# EAGLE design transponder-9.3.0 (EAGLE 9.6.1)

## Sheet 1 of 7
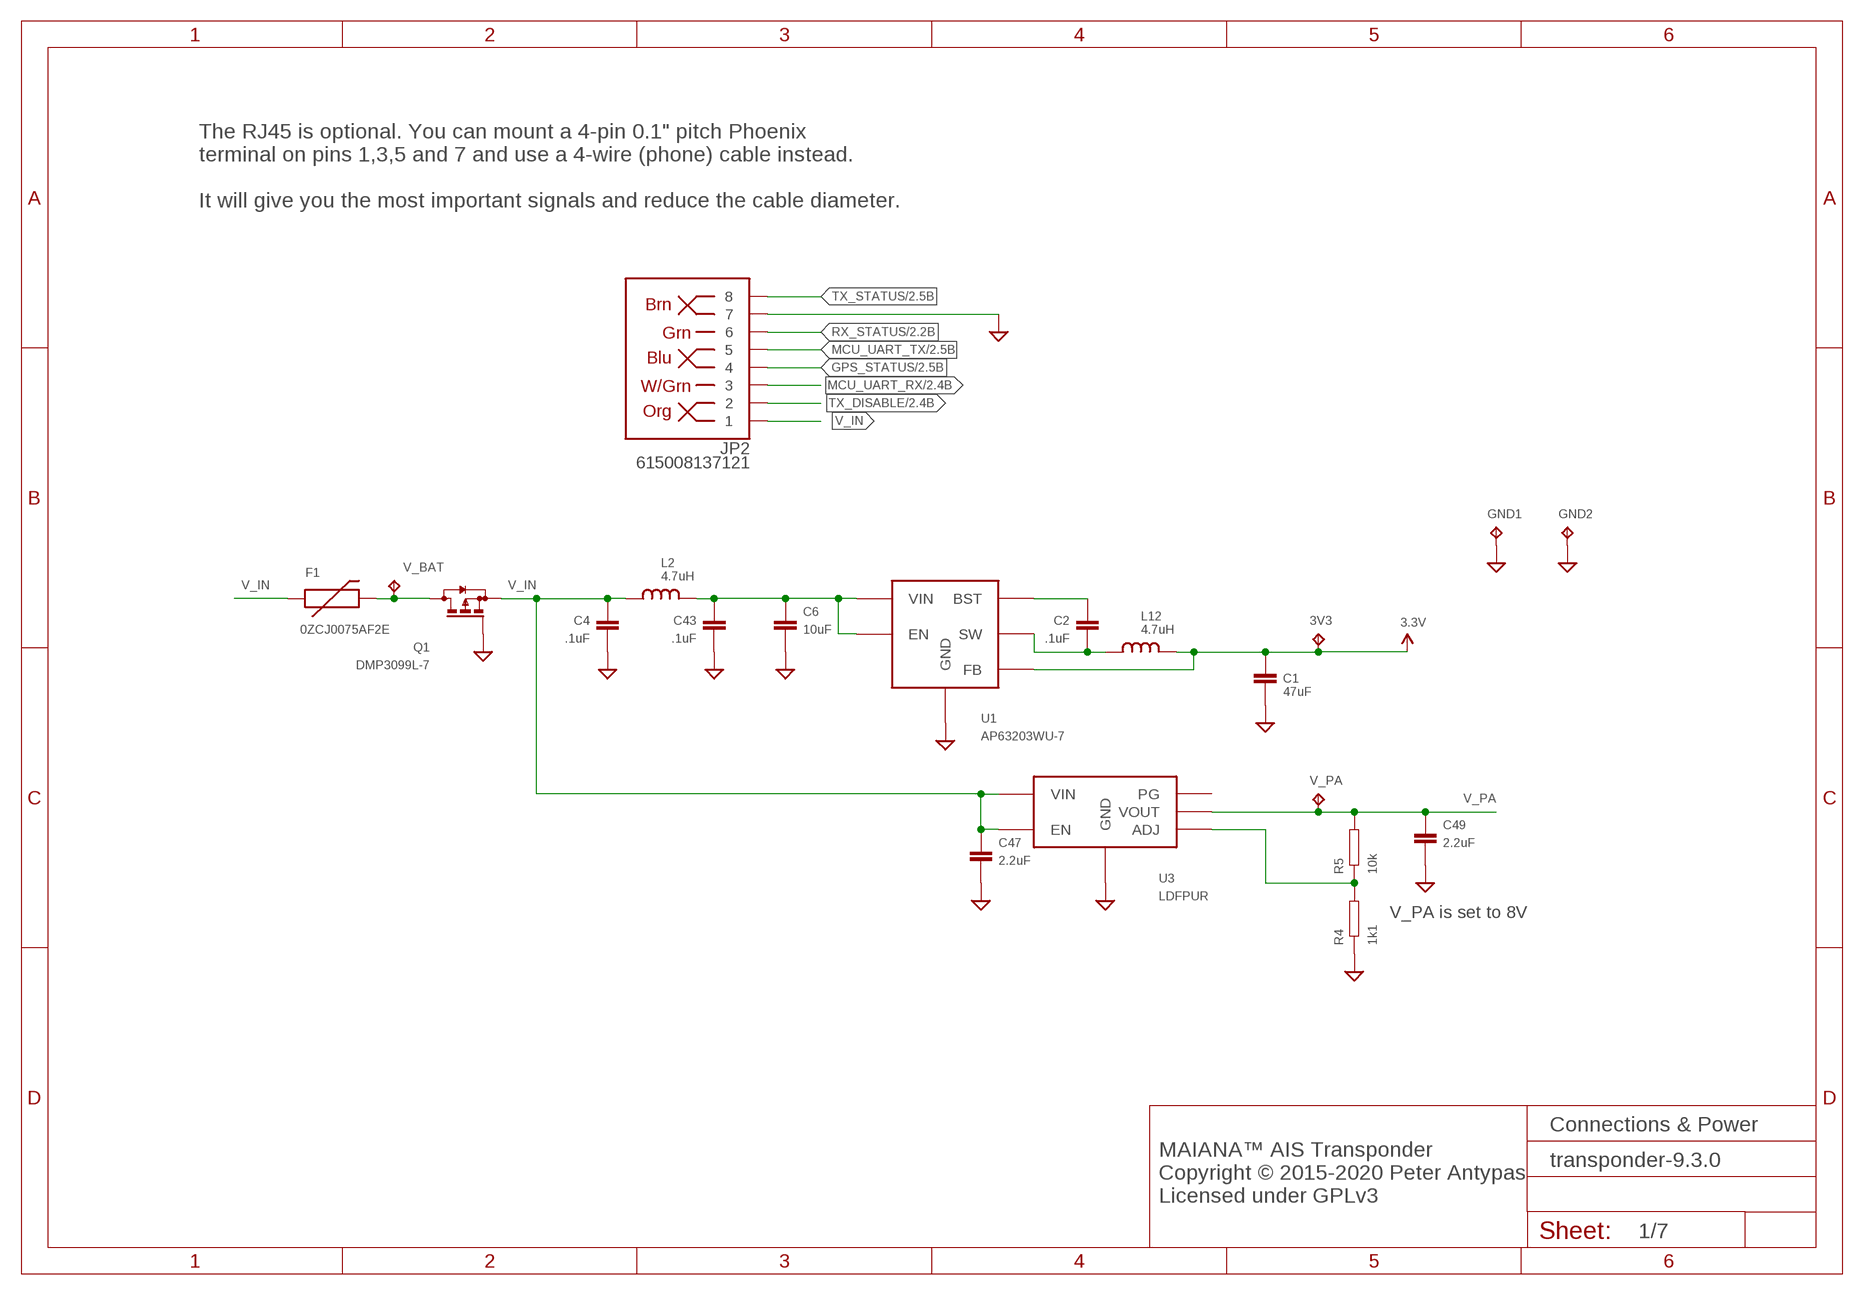
[diagram p0: schematic, sheet 1]

### Parts
3V3  TPTP12R  [TP12R]
C1  47uF  CAPACITOR1206  [1206]
C2  .1uF  CAPACITOR0603  [0603]
C4  .1uF  CAPACITOR0603  [0603]
C6  10uF  CAPACITOR0805  [0805]
C43  .1uF  CAPACITOR0603  [0603]
C47  2.2uF  CAPACITOR0603  [0603]
C49  2.2uF  CAPACITOR0603  [0603]
F1  0ZCJ0075AF2E  PTCSMD  [PTC-1206]
GND1  TPTP16R  [TP16R]
GND2  TPTP16R  [TP16R]
JP2  615008137121  RJ45-8PTH  [RJ45-8]
L2  4.7uH  INDUCTOR0805  [0805]
L12  4.7uH  INDUCTOR0805  [0805]
Q1  DMP3099L-7  BSS84  [SOT23]
R4  1k1  RESISTOR0603  [0603]
R5  10k  RESISTOR0603  [0603]
U1  AP63203WU-7  AP63203  [SOT23-6]
U3  LDFPUR  LDF  [DFN-6]
V_BAT  TPTP12R  [TP12R]
V_PA  TPTP12R  [TP12R]

### Nets
3.3V: 3V3.TP C1.P$1 L12.P$2 U1.1(FB) ; also sheet 2,3,4,6,7
BST: C2.P$1 U1.6(BST)
GND: C1.P$2 C4.P$2 C6.P$2 C43.P$2 C47.P$2 C49.P$2 GND1.TP GND2.TP JP2.7 Q1.1(G) R4.P$1 U1.4(GND) U3.P$4(GND) U3.P$7(GND) ; also sheet 2,3,4,5,6,7
GPS_STATUS: JP2.4 ; also sheet 2
MCU_UART_RX: JP2.3 ; also sheet 2
MCU_UART_TX: JP2.5 ; also sheet 2
N$27: C6.P$1 C43.P$1 L2.P$2 U1.2(EN) U1.3(VIN)
N$32: R4.P$2 R5.P$1 U3.P$2(ADJ)
RX_STATUS: JP2.6 ; also sheet 2
SW: C2.P$2 L12.P$1 U1.5(SW)
TX_DISABLE: JP2.2 ; also sheet 2
TX_STATUS: JP2.8 ; also sheet 2
V_BAT: F1.2 Q1.3(D) V_BAT.TP
V_IN: C4.P$1 C47.P$1 F1.1 JP2.1 L2.P$1 Q1.2(S) U3.P$5(EN) U3.P$6(VIN)
V_PA: C49.P$1 R5.P$2 U3.P$1(VOUT) V_PA.TP ; also sheet 5
Unconnected: U3.P$3(PG)

### Notes on the sheet
- The RJ45 is optional. You can mount a 4-pin 0.1" pitch Phoenix 
  terminal on pins 1,3,5 and 7 and use a 4-wire (phone) cable instead.
  
  It will give you the most important signals and reduce the cable diameter.
- V_PA is set to 8V
- Connections & Power
- MAIANA™ AIS Transponder
  Copyright © 2015-2020 Peter Antypas
  Licensed under GPLv3

## Sheet 2 of 7
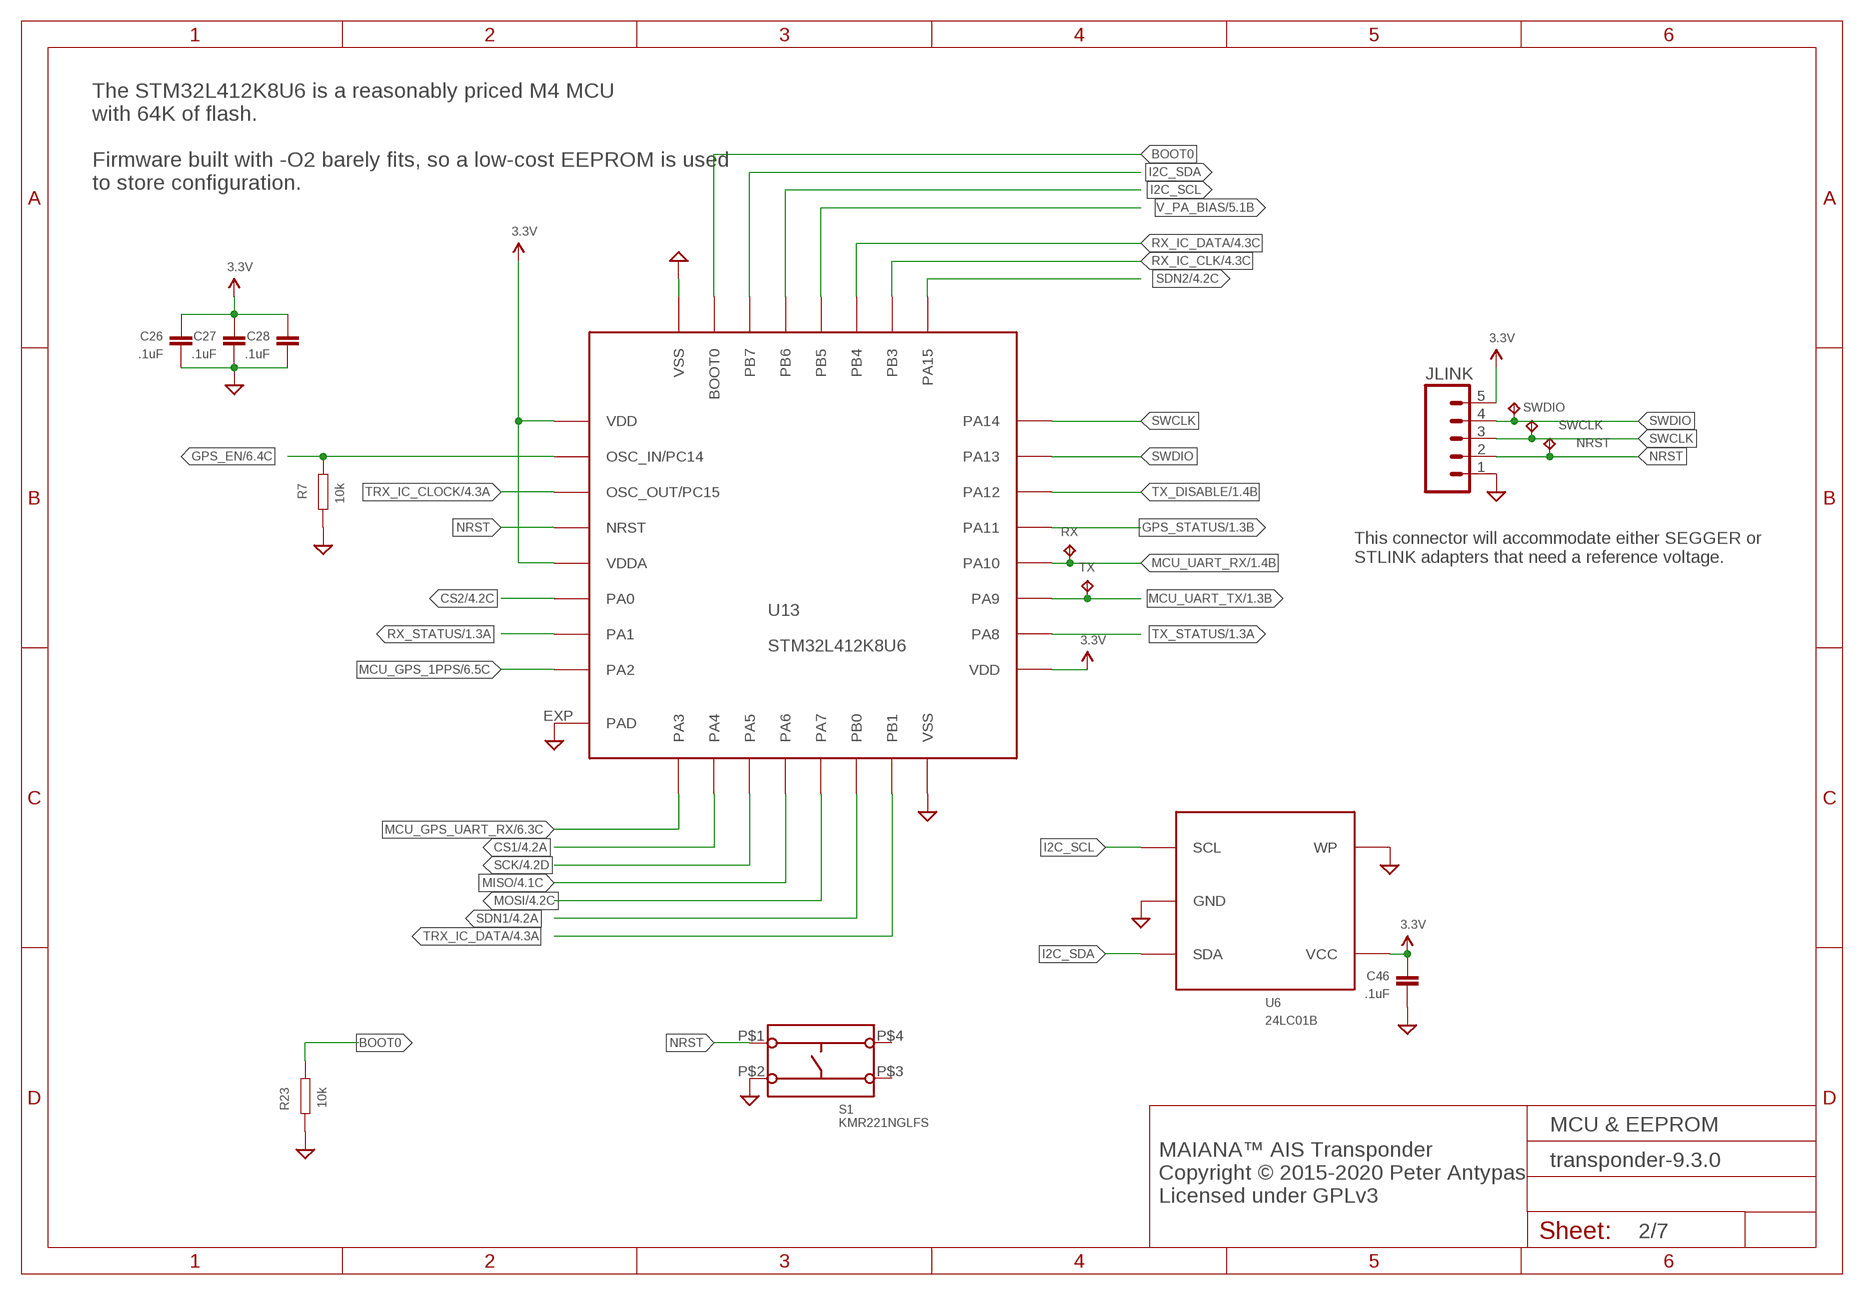
[diagram p1: schematic, sheet 2]

### Parts
C26  .1uF  CAPACITOR0603  [0603]
C27  .1uF  CAPACITOR0603  [0603]
C28  .1uF  CAPACITOR0603  [0603]
C46  .1uF  CAPACITOR0603  [0603]
JLINK  M05PTH  [1X05]
NRST  TPTP12R  [TP12R]
R7  10k  RESISTOR0603  [0603]
R23  10k  RESISTOR0603  [0603]
RX  TPTP12R  [TP12R]
S1  KMR221NGLFS  [KMR221NGLFS]
SWCLK  TPTP12R  [TP12R]
SWDIO  TPTP12R  [TP12R]
TX  TPTP12R  [TP12R]
U6  24LC01B  [SOT23-5]
U13  STM32L412K8U6  STM32L432KXXX  [QFN32]

### Nets
3.3V: C26.P$1 C27.P$1 C28.P$1 C46.P$1 JLINK.5 U6.4(VCC) U13.1(VDD) U13.5(VDDA) U13.17(VDD) ; also sheet 1,3,4,6,7
BOOT0: R23.P$1 U13.31(BOOT0)
CS1: U13.10(PA4) ; also sheet 4
CS2: U13.6(PA0) ; also sheet 4
GND: C26.P$2 C27.P$2 C28.P$2 C46.P$2 JLINK.1 R7.P$2 R23.P$2 S1.P$2(S2) U6.2(GND) U6.5(WP) U13.16(VSS) U13.32(VSS) U13.EXP(PAD) ; also sheet 1,3,4,5,6,7
GPS_EN: R7.P$1 U13.2(OSC_IN/PC14) ; also sheet 6
GPS_STATUS: U13.21(PA11) ; also sheet 1
I2C_SCL: U6.1(SCL) U13.29(PB6)
I2C_SDA: U6.3(SDA) U13.30(PB7)
MCU_GPS_1PPS: U13.8(PA2) ; also sheet 6
MCU_GPS_UART_RX: U13.9(PA3) ; also sheet 6
MCU_UART_RX: RX.TP U13.20(PA10) ; also sheet 1
MCU_UART_TX: TX.TP U13.19(PA9) ; also sheet 1
MISO: U13.12(PA6) ; also sheet 4
MOSI: U13.13(PA7) ; also sheet 4
NRST: JLINK.2 NRST.TP S1.P$1(S1) U13.4(NRST)
RX_IC_CLK: U13.26(PB3) ; also sheet 4
RX_IC_DATA: U13.27(PB4) ; also sheet 4
RX_STATUS: U13.7(PA1) ; also sheet 1
SCK: U13.11(PA5) ; also sheet 4
SDN1: U13.14(PB0) ; also sheet 4
SDN2: U13.25(PA15) ; also sheet 4
SWCLK: JLINK.3 SWCLK.TP U13.24(PA14)
SWDIO: JLINK.4 SWDIO.TP U13.23(PA13)
TRX_IC_CLOCK: U13.3(OSC_OUT/PC15) ; also sheet 4
TRX_IC_DATA: U13.15(PB1) ; also sheet 4
TX_DISABLE: U13.22(PA12) ; also sheet 1
TX_STATUS: U13.18(PA8) ; also sheet 1
V_PA_BIAS: U13.28(PB5) ; also sheet 5
Unconnected: S1.P$3(S2) S1.P$4(S1)

### Notes on the sheet
- The STM32L412K8U6 is a reasonably priced M4 MCU
  with 64K of flash. 
  
  Firmware built with -O2 barely fits, so a low-cost EEPROM is used
  to store configuration.
- This connector will accommodate either SEGGER or
  STLINK adapters that need a reference voltage.
- MCU & EEPROM
- MAIANA™ AIS Transponder
  Copyright © 2015-2020 Peter Antypas
  Licensed under GPLv3

## Sheet 3 of 7
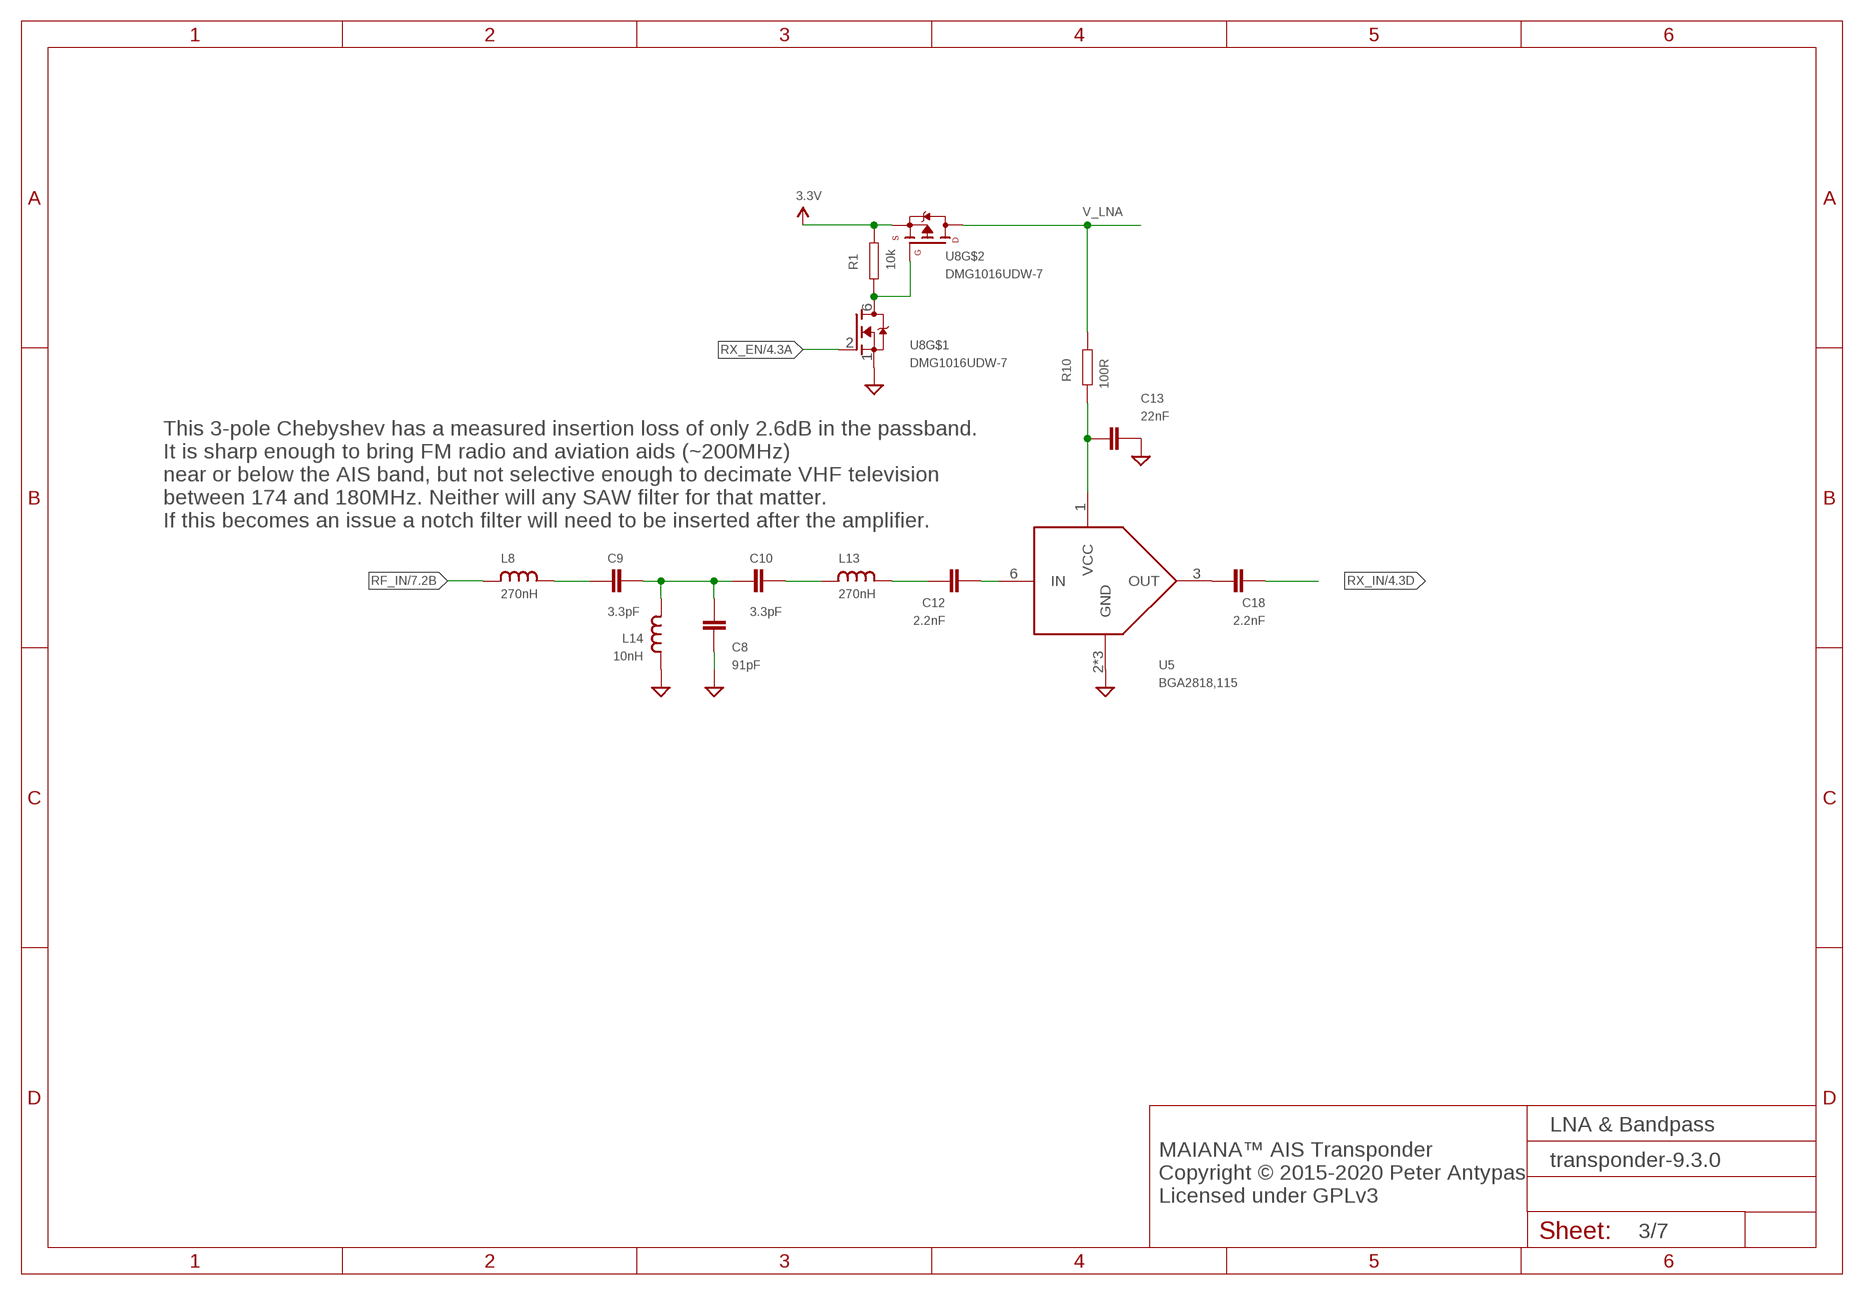
[diagram p2: schematic, sheet 3]

### Parts
C8  91pF  CAPACITOR0603  [0603]
C9  3.3pF  CAPACITOR0603  [0603]
C10  3.3pF  CAPACITOR0603  [0603]
C12  2.2nF  CAPACITOR0603  [0603]
C13  22nF  CAPACITOR0603  [0603]
C18  2.2nF  CAPACITOR0603  [0603]
L8  270nH  INDUCTOR0603  [0603]
L13  270nH  INDUCTOR0603  [0603]
L14  10nH  INDUCTOR0603  [0603]
R1  10k  RESISTOR0603  [0603]
R10  100R  RESISTOR0603  [0603]
U5  BGA2818,115  BGA2870  [SOT363]
U8  DMG1016UDW-7  DMG1016UDW  [SOT363]

### Nets
3.3V: R1.P$2 U8.4(S) ; also sheet 1,2,4,6,7
GND: C8.P$2 C13.P$2 L14.P$1 U5.2(GND) U5.4(GND) U5.5(GND) U8.1(S) ; also sheet 1,2,4,5,6,7
N$1: C12.P$2 U5.6(IN)
N$2: C9.P$1 L8.P$2
N$3: C8.P$1 C9.P$2 C10.P$1 L14.P$2
N$4: C10.P$2 L13.P$1
N$5: C12.P$1 L13.P$2
N$6: C13.P$1 R10.P$2 U5.1(VCC)
N$9: C18.P$1 U5.3(OUT)
N$10: R1.P$1 U8.5(G) U8.6(D)
RF_IN: L8.P$1 ; also sheet 7
RX_EN: U8.2(G) ; also sheet 4,7
RX_IN: C18.P$2 ; also sheet 4
V_LNA: R10.P$1 U8.3(D)

### Notes on the sheet
- This 3-pole Chebyshev has a measured insertion loss of only 2.6dB in the passband.
  It is sharp enough to bring FM radio and aviation aids (~200MHz)
  near or below the AIS band, but not selective enough to decimate VHF television
  between 174 and 180MHz. Neither will any SAW filter for that matter. 
  If this becomes an issue a notch filter will need to be inserted after the amplifier.
- LNA & Bandpass
- MAIANA™ AIS Transponder
  Copyright © 2015-2020 Peter Antypas
  Licensed under GPLv3

## Sheet 4 of 7
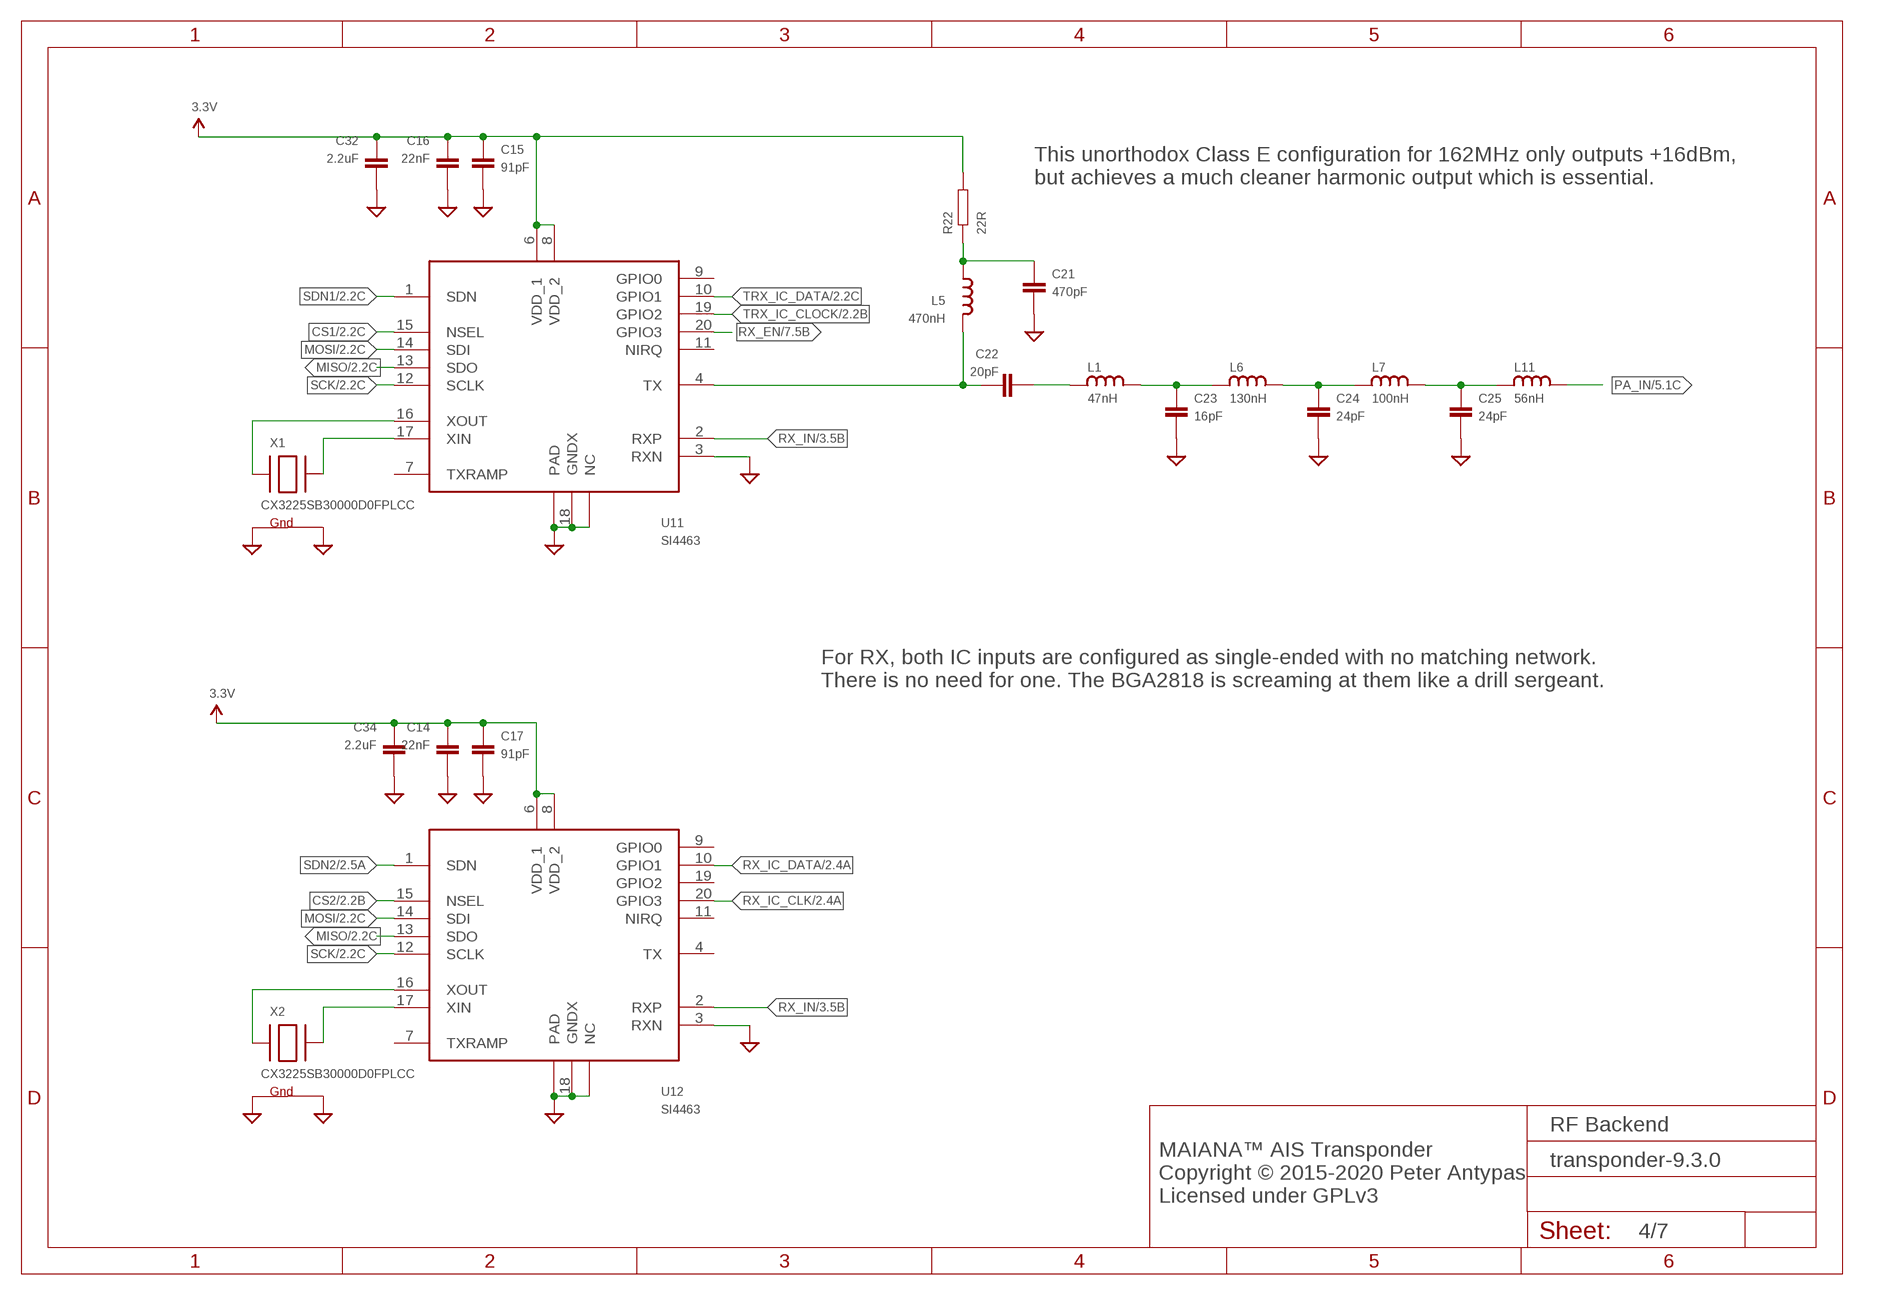
[diagram p3: schematic, sheet 4]

### Parts
C14  22nF  CAPACITOR0603  [0603]
C15  91pF  CAPACITOR0603  [0603]
C16  22nF  CAPACITOR0603  [0603]
C17  91pF  CAPACITOR0603  [0603]
C21  470pF  CAPACITOR0603  [0603]
C22  20pF  CAPACITOR0603  [0603]
C23  16pF  CAPACITOR0603  [0603]
C24  24pF  CAPACITOR0603  [0603]
C25  24pF  CAPACITOR0603  [0603]
C32  2.2uF  CAPACITOR0603  [0603]
C34  2.2uF  CAPACITOR0603  [0603]
L1  47nH  INDUCTOR0603  [0603]
L5  470nH  INDUCTOR0603  [0603]
L6  130nH  INDUCTOR0603  [0603]
L7  100nH  INDUCTOR0603  [0603]
L11  56nH  INDUCTOR0603  [0603]
R22  22R  RESISTOR0603  [0603]
U11  SI4463  [SI4463]
U12  SI4463  [SI4463]
X1  CX3225SB30000D0FPLCC  XTAL-4-3225  [NX3225]
X2  CX3225SB30000D0FPLCC  XTAL-4-3225  [NX3225]

### Nets
3.3V: C14.P$1 C15.P$1 C16.P$1 C17.P$1 C32.P$1 C34.P$1 R22.P$2 U11.6(VDD_1) U11.8(VDD_2) U12.6(VDD_1) U12.8(VDD_2) ; also sheet 1,2,3,6,7
CS1: U11.15(NSEL) ; also sheet 2
CS2: U12.15(NSEL) ; also sheet 2
GND: C14.P$2 C15.P$2 C16.P$2 C17.P$2 C21.P$2 C23.P$2 C24.P$2 C25.P$2 C32.P$2 C34.P$2 U11.3(RXN) U11.5(NC) U11.18(GNDX) U11.EXP(PAD) U12.3(RXN) U12.5(NC) U12.18(GNDX) U12.EXP(PAD) X1.2(G2) X1.4(G1) X2.2(G2) X2.4(G1) ; also sheet 1,2,3,5,6,7
MISO: U11.13(SDO) U12.13(SDO) ; also sheet 2
MOSI: U11.14(SDI) U12.14(SDI) ; also sheet 2
N$7: C24.P$1 L6.P$2 L7.P$1
N$11: C25.P$1 L7.P$2 L11.P$1
N$12: C23.P$1 L1.P$2 L6.P$1
N$16: U12.16(XOUT) X2.1(X1)
N$17: U12.17(XIN) X2.3(X2)
N$18: U11.16(XOUT) X1.1(X1)
N$19: U11.17(XIN) X1.3(X2)
N$24: C22.P$1 L5.P$2 U11.4(TX)
N$30: C21.P$1 L5.P$1 R22.P$1
N$31: C22.P$2 L1.P$1
PA_IN: L11.P$2 ; also sheet 5
RX_EN: U11.20(GPIO3) ; also sheet 3,7
RX_IC_CLK: U12.20(GPIO3) ; also sheet 2
RX_IC_DATA: U12.10(GPIO1) ; also sheet 2
RX_IN: U11.2(RXP) U12.2(RXP) ; also sheet 3
SCK: U11.12(SCLK) U12.12(SCLK) ; also sheet 2
SDN1: U11.1(SDN) ; also sheet 2
SDN2: U12.1(SDN) ; also sheet 2
TRX_IC_CLOCK: U11.19(GPIO2) ; also sheet 2
TRX_IC_DATA: U11.10(GPIO1) ; also sheet 2
Unconnected: U11.7(TXRAMP) U11.9(GPIO0) U11.11(NIRQ) U12.4(TX) U12.7(TXRAMP) U12.9(GPIO0) U12.11(NIRQ) U12.19(GPIO2)

### Notes on the sheet
- This unorthodox Class E configuration for 162MHz only outputs +16dBm,  
  but achieves a much cleaner harmonic output which is essential.
- For RX, both IC inputs are configured as single-ended with no matching network. 
  There is no need for one. The BGA2818 is screaming at them like a drill sergeant.
- RF Backend
- MAIANA™ AIS Transponder
  Copyright © 2015-2020 Peter Antypas
  Licensed under GPLv3

## Sheet 5 of 7
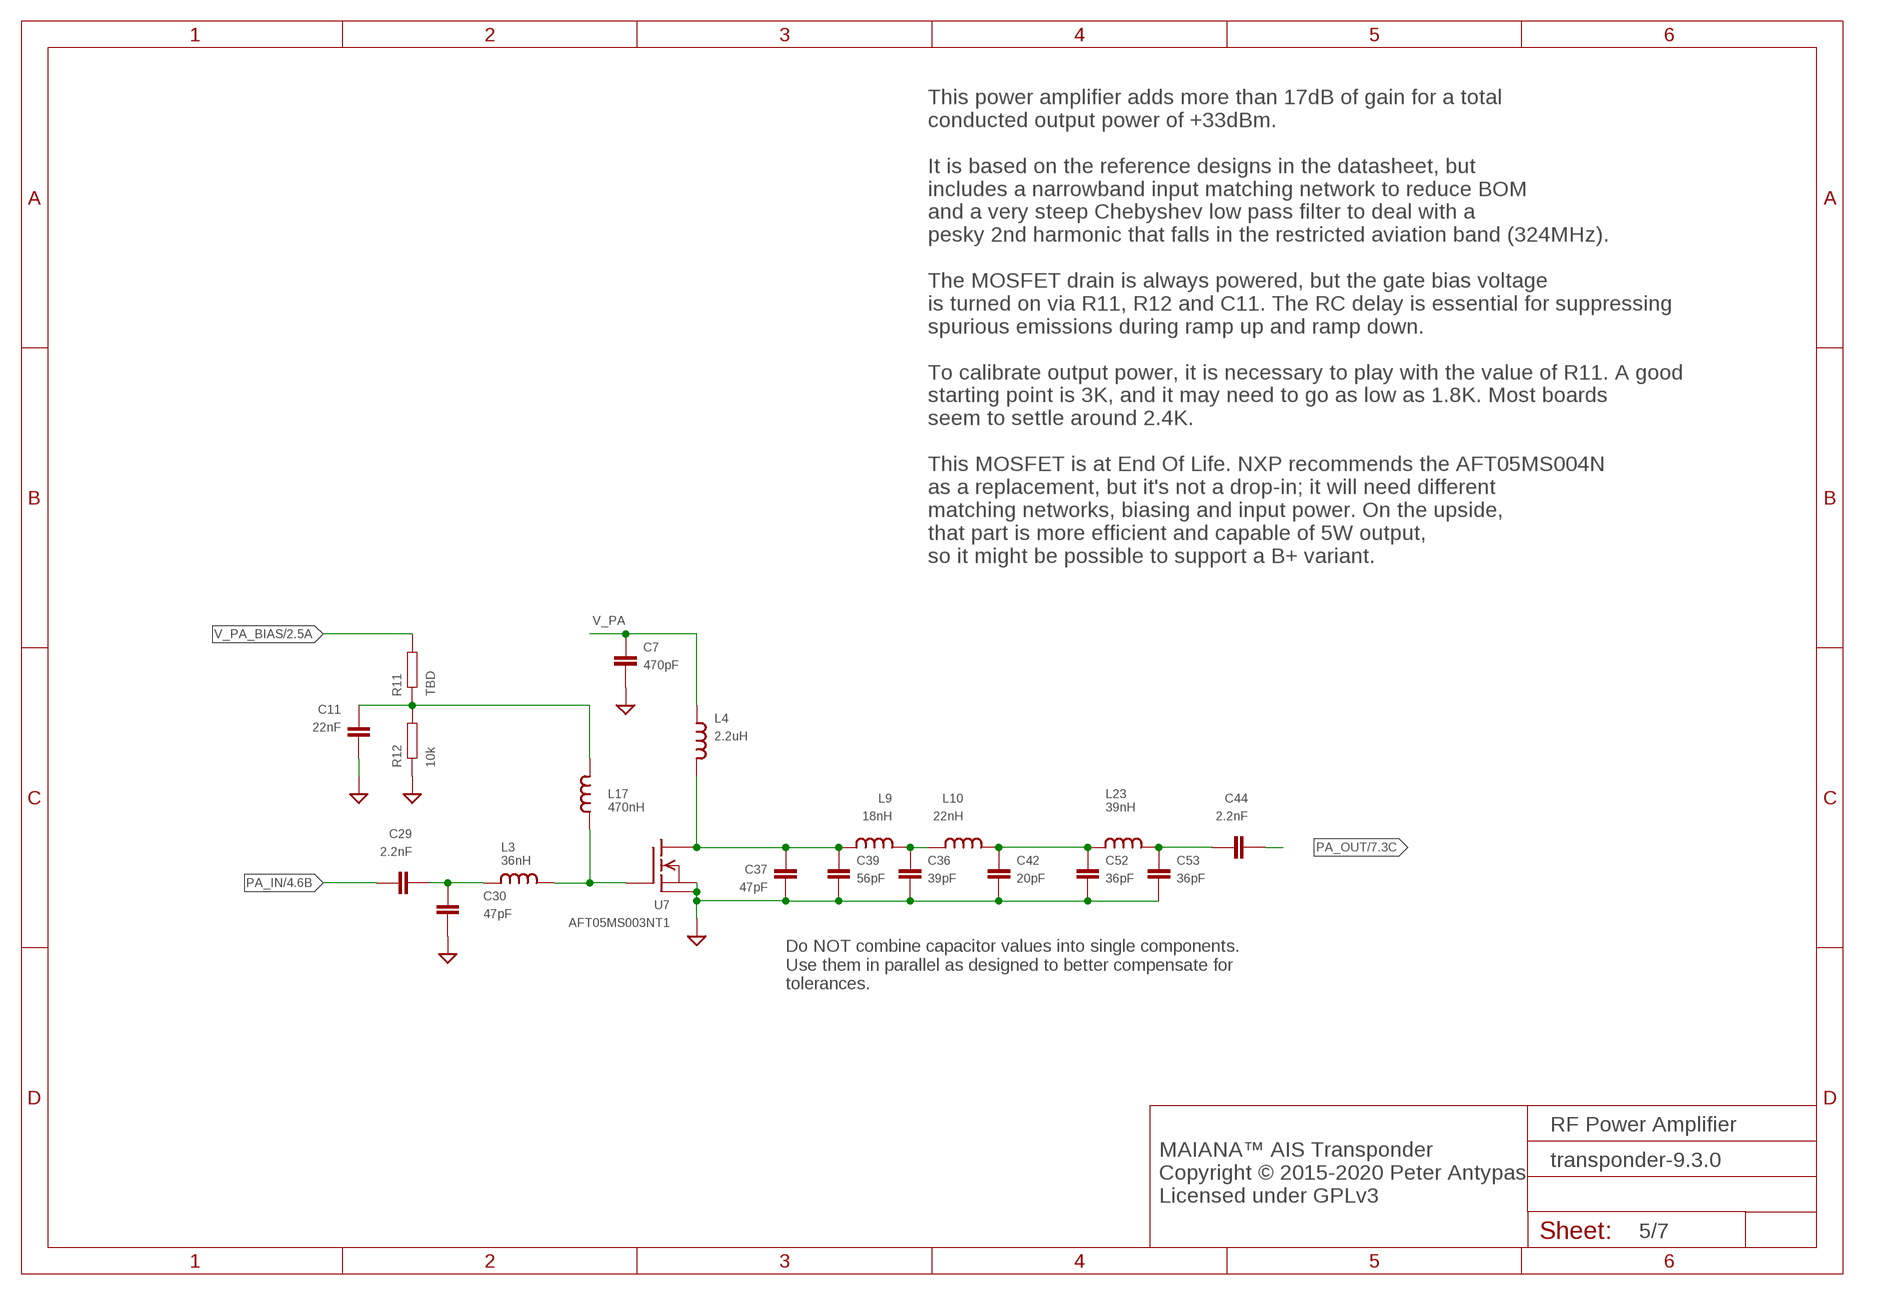
[diagram p4: schematic, sheet 5]

### Parts
C7  470pF  CAPACITOR0603  [0603]
C11  22nF  CAPACITOR0603  [0603]
C29  2.2nF  CAPACITOR0603  [0603]
C30  47pF  CAPACITOR0603  [0603]
C36  39pF  CAPACITOR0603  [0603]
C37  47pF  CAPACITOR0603  [0603]
C39  56pF  CAPACITOR0603  [0603]
C42  20pF  CAPACITOR0603  [0603]
C44  2.2nF  CAPACITOR0603  [0603]
C52  36pF  CAPACITOR0603  [0603]
C53  36pF  CAPACITOR0603  [0603]
L3  36nH  INDUCTOR0603  [0603]
L4  2.2uH  INDUCTOR0805  [0805]
L9  18nH  INDUCTOR0603  [0603]
L10  22nH  INDUCTOR0603  [0603]
L17  470nH  INDUCTOR0603  [0603]
L23  39nH  INDUCTOR0603  [0603]
R11  TBD  RESISTOR0603  [0603]
R12  10k  RESISTOR0603  [0603]
U7  AFT05MS003NT1  AFT0SMS003N  [SOT-89]

### Nets
GND: C7.P$2 C11.P$2 C30.P$2 C36.P$2 C37.P$2 C39.P$2 C42.P$2 C52.P$2 C53.P$2 R12.P$1 U7.2(S) U7.2@1(PAD) ; also sheet 1,2,3,4,6,7
N$8: C11.P$1 L17.P$2 R11.P$1 R12.P$2
N$23: C37.P$1 C39.P$1 L4.P$2 L9.P$1 U7.3(D)
N$26: L3.P$2 L17.P$1 U7.1(G)
N$28: C36.P$1 L9.P$2 L10.P$1
N$29: C29.P$2 C30.P$1 L3.P$1
N$40: C42.P$1 C52.P$1 L10.P$2 L23.P$1
N$41: C44.P$1 C53.P$1 L23.P$2
PA_IN: C29.P$1 ; also sheet 4
PA_OUT: C44.P$2 ; also sheet 7
V_PA: C7.P$1 L4.P$1 ; also sheet 1
V_PA_BIAS: R11.P$2 ; also sheet 2

### Notes on the sheet
- This power amplifier adds more than 17dB of gain for a total
  conducted output power of +33dBm. 
  
  It is based on the reference designs in the datasheet, but
  includes a narrowband input matching network to reduce BOM
  and a very steep Chebyshev low pass filter to deal with a
  pesky 2nd harmonic that falls in the restricted aviation band (324MHz).
  
  The MOSFET drain is always powered, but the gate bias voltage
  is turned on via R11, R12 and C11. The RC delay is essential for suppressing
  spurious emissions during ramp up and ramp down.
  
  To calibrate output power, it is necessary to play with the value of R11. A good
  starting point is 3K, and it may need to go as low as 1.8K. Most boards
  seem to settle around 2.4K.
  
  This MOSFET is at End Of Life. NXP recommends the AFT05MS004N 
  as a replacement, but it's not a drop-in; it will need different
  matching networks, biasing and input power. On the upside, 
  that part is more efficient and capable of 5W output,
  so it might be possible to support a B+ variant.
- Do NOT combine capacitor values into single components. 
  Use them in parallel as designed to better compensate for
  tolerances.
- RF Power Amplifier
- MAIANA™ AIS Transponder
  Copyright © 2015-2020 Peter Antypas
  Licensed under GPLv3

## Sheet 6 of 7
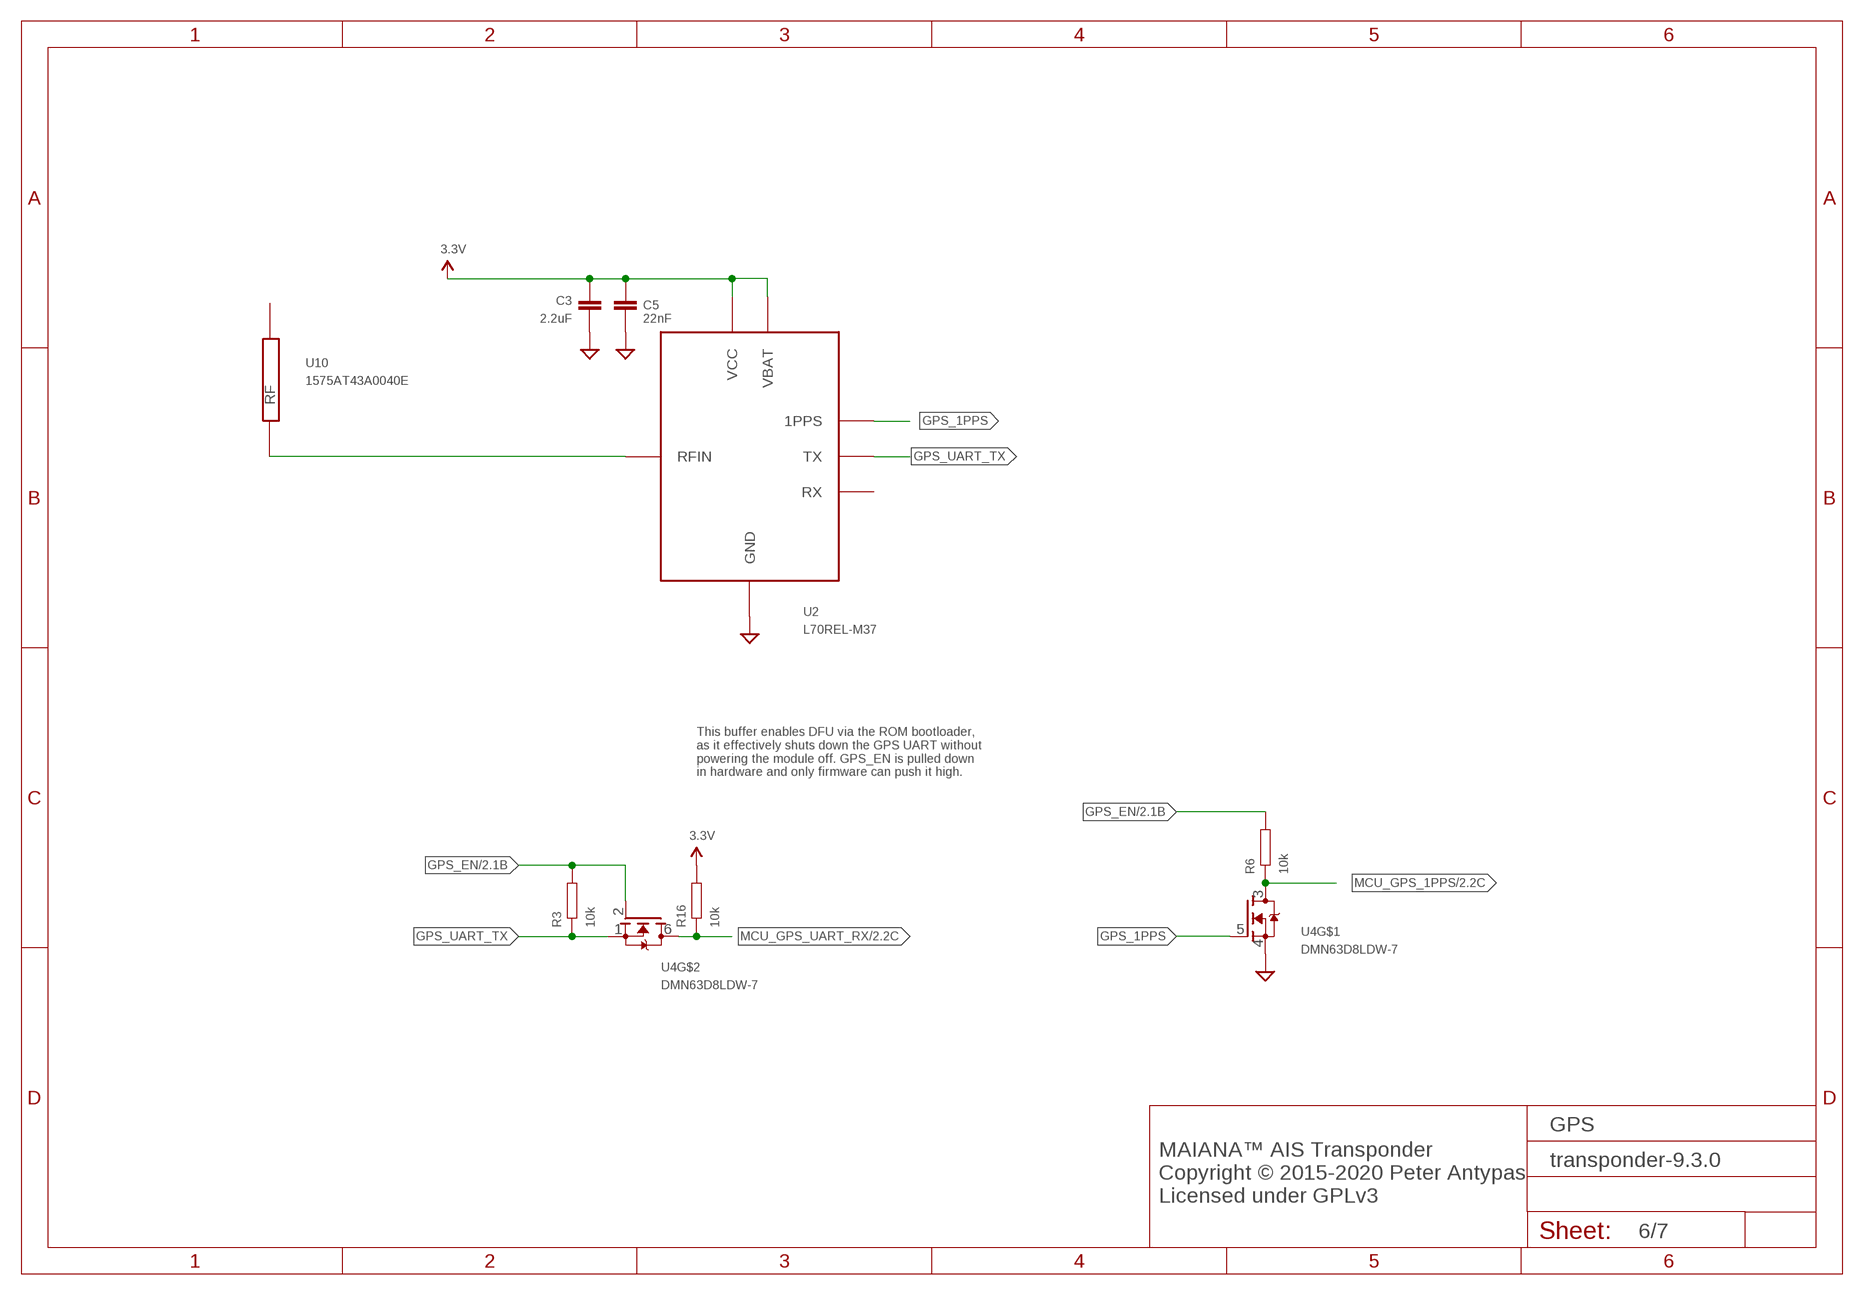
[diagram p5: schematic, sheet 6]

### Parts
C3  2.2uF  CAPACITOR0603  [0603]
C5  22nF  CAPACITOR0603  [0603]
R3  10k  RESISTOR0603  [0603]
R6  10k  RESISTOR0603  [0603]
R16  10k  RESISTOR0603  [0603]
U2  L70REL-M37  L70  [GPS_MODULE]
U4  DMN63D8LDW-7  DMN63D8LDW  [SOT363]
U10  1575AT43A0040E  [1575AT43A0040E]

### Nets
3.3V: C3.P$1 C5.P$1 R16.P$2 U2.P$6(VBAT) U2.P$8(VCC) ; also sheet 1,2,3,4,7
GND: C3.P$2 C5.P$2 U2.P$1(GND) U2.P$10(GND) U2.P$12(GND) U4.4(S) ; also sheet 1,2,3,4,5,7
GPS_1PPS: U2.P$4(1PPS) U4.5(G)
GPS_EN: R3.P$2 R6.P$2 U4.2(G) ; also sheet 2
GPS_UART_TX: R3.P$1 U2.P$2(TX) U4.1(S)
MCU_GPS_1PPS: R6.P$1 U4.3(D) ; also sheet 2
MCU_GPS_UART_RX: R16.P$1 U4.6(D) ; also sheet 2
N$25: U2.P$11(RFIN) U10.P$1(RF)
Unconnected: U2.P$3(RX) U10.P$2(PAD)

### Notes on the sheet
- This buffer enables DFU via the ROM bootloader,
  as it effectively shuts down the GPS UART without
  powering the module off. GPS_EN is pulled down
  in hardware and only firmware can push it high.
- GPS
- MAIANA™ AIS Transponder
  Copyright © 2015-2020 Peter Antypas
  Licensed under GPLv3

## Sheet 7 of 7
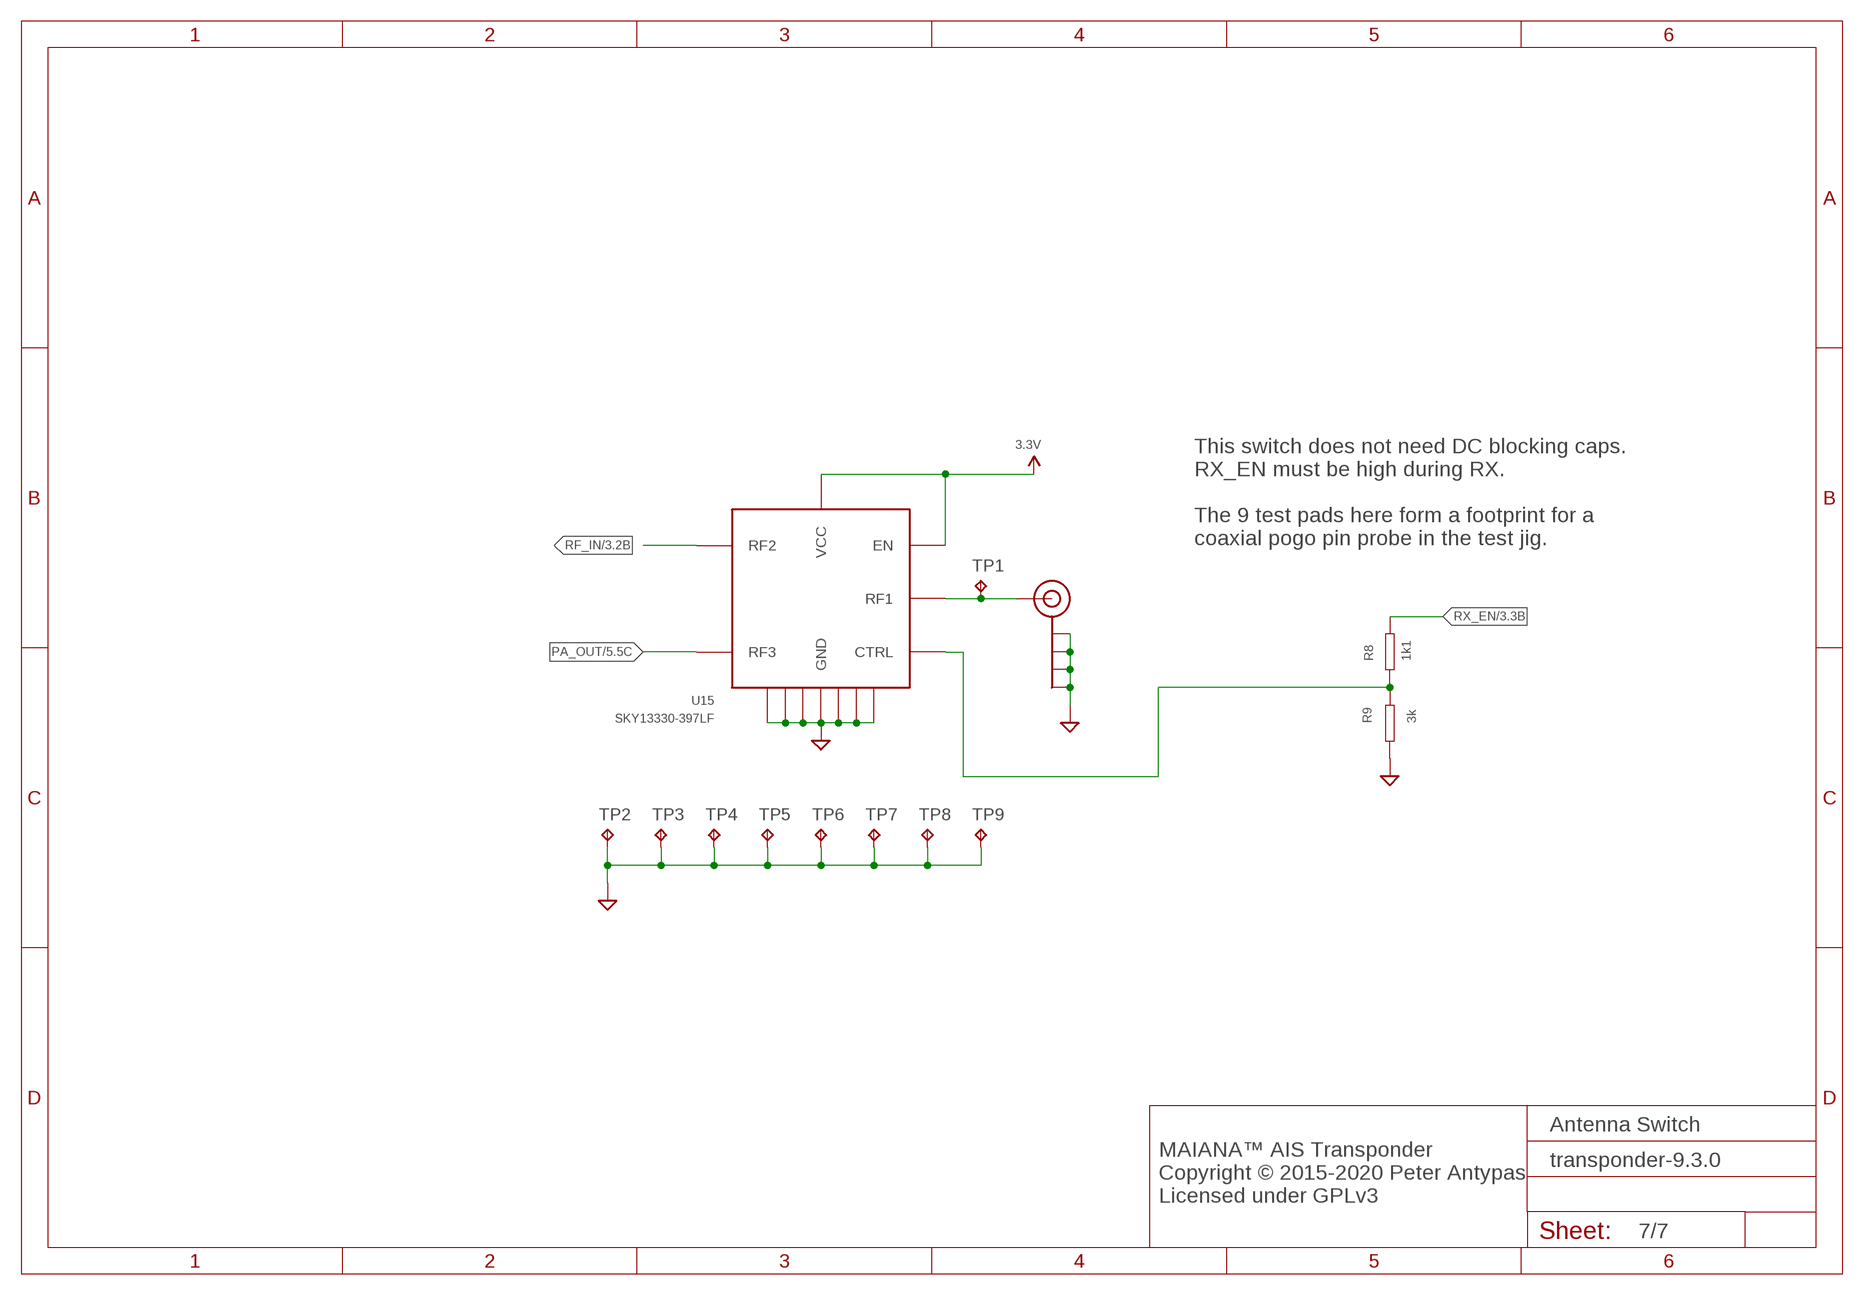
[diagram p6: schematic, sheet 7]

### Parts
J$1  SMA_EDGE  [SMA-EDGE]
R8  1k1  RESISTOR0603  [0603]
R9  3k  RESISTOR0603  [0603]
TP1  TPTP10R  [TP10R]
TP2  TPTP08R  [TP08R]
TP3  TPTP08R  [TP08R]
TP4  TPTP08R  [TP08R]
TP5  TPTP08R  [TP08R]
TP6  TPTP08R  [TP08R]
TP7  TPTP08R  [TP08R]
TP8  TPTP08R  [TP08R]
TP9  TPTP08R  [TP08R]
U15  SKY13330-397LF  SKYWORKS-13330397LF  [QFN12]

### Nets
1V8: R8.P$1 R9.P$2 U15.P$7(CTRL)
3.3V: U15.P$8(EN) U15.P$9(VCC) ; also sheet 1,2,3,4,6
GND: J$1.GND@0(GND) J$1.GND@1(GND) J$1.GND@2(GND) J$1.GND@3(GND) R9.P$1 TP2.TP TP3.TP TP4.TP TP5.TP TP6.TP TP7.TP TP8.TP TP9.TP U15.P$1(GND) U15.P$3(GND) U15.P$4(GND) U15.P$6(GND) U15.P$10(GND) U15.P$12(GND) U15.P$13(GND) ; also sheet 1,2,3,4,5,6
N$15: J$1.SIG(SIGNAL) TP1.TP U15.P$2(RF1)
PA_OUT: U15.P$5(RF3) ; also sheet 5
RF_IN: U15.P$11(RF2) ; also sheet 3
RX_EN: R8.P$2 ; also sheet 3,4

### Notes on the sheet
- This switch does not need DC blocking caps.
  RX_EN must be high during RX.
  
  The 9 test pads here form a footprint for a
  coaxial pogo pin probe in the test jig.
- Antenna Switch
- MAIANA™ AIS Transponder
  Copyright © 2015-2020 Peter Antypas
  Licensed under GPLv3

## Library data of the parts
3V3 GND1 GND2 NRST RX SWCLK SWDIO TP1-TP9 TX V_BAT V_PA = testpad:TP: Test pad; DNP: T
C1 = MyPassives:CAPACITOR: Standard SMD capacitor; PARTNO: CL31A476MQHNNNE
C2 C4 C26-C28 C43 C46 = MyPassives:CAPACITOR: Standard SMD capacitor; PARTNO: EMK107B7104KAHT
C3 C32 C34 C47 C49 = MyPassives:CAPACITOR: Standard SMD capacitor; PARTNO: EMK107BJ225KA-T
C5 C11 C13 C14 C16 = MyPassives:CAPACITOR: Standard SMD capacitor; PARTNO: GRM188R71E223KA01D
C6 = MyPassives:CAPACITOR: Standard SMD capacitor; PARTNO: EMK212ABJ106KG-T
C7 C21 = MyPassives:CAPACITOR: Standard SMD capacitor; PARTNO: GRM1885C1H471JA01D
C8 C15 C17 = MyPassives:CAPACITOR: Standard SMD capacitor; PARTNO: GRM1885C2A910JA01D
C9 C10 = MyPassives:CAPACITOR: Standard SMD capacitor; PARTNO: GRM1885C1H3R3BA01D
C12 C18 C29 C44 = MyPassives:CAPACITOR: Standard SMD capacitor; PARTNO: GRM1885C1H222JA01J
C22 C42 = MyPassives:CAPACITOR: Standard SMD capacitor; PARTNO: GRM1885C1H200JA01D
C23 = MyPassives:CAPACITOR: Standard SMD capacitor; PARTNO: GCM1885C2A160JA16D
C24 C25 = MyPassives:CAPACITOR: Standard SMD capacitor; PARTNO: GRM1885C2A240JA01D
C30 C37 = MyPassives:CAPACITOR: Standard SMD capacitor; PARTNO: GRM1885C1H470JA01J
C36 = MyPassives:CAPACITOR: Standard SMD capacitor; PARTNO: GRM1885C1H390JA01D
C39 = MyPassives:CAPACITOR: Standard SMD capacitor; PARTNO: GRM1885C1H560JA01D
C52 C53 = MyPassives:CAPACITOR: Standard SMD capacitor; PARTNO: 06035A360JAT2A
F1 = SparkFun-PowerIC:PTC: Resettable Fuse PTC Resettable Fuse. Spark Fun Electronics SKU : COM-08357; PARTNO: 0ZCJ0075AF2E; PROD_ID: RES-11150
J$1 = SparkFun-Connectors:SMA_EDGE: SMA Antenna Connector End launch SMA connector. The paste layer has been removed so that the connector can be hand soldered onto the board after reflow.; DNP: T
JLINK = SparkFun-Connectors:M05: Header 5 Standard 5-pin 0.1" header. Use with straight break away headers (SKU : PRT-00116), right angle break away headers (PRT-00553), swiss pins (PRT-00743), machine pins (PRT-00117), and female headers (PRT-00115). Molex polarized connector foot print use with SKU : PRT-08230 with associated crimp pins and housings.; DNP: T
JP2 = SparkFun-Connectors:RJ45-8: RJ45 Jack Simple RJ45, 8-pin connection - connector for common Cat5, Cat5e, and Cat6 Ethernet cables. Footprint not yet proven in production. Connector sku is PRT-00643; Breakout PCB sku is BOB-00716.; PARTNO: ‎615008137121‎; PROD_ID: CONN-08506; VALUE: RJ45
L1 = MyPassives:INDUCTOR: Standard SMD inductor; PARTNO: LQW18AN47NG00D
L2 L12 = MyPassives:INDUCTOR: Standard SMD inductor; PARTNO: MLZ2012M4R7WT000
L3 = MyPassives:INDUCTOR: Standard SMD inductor; PARTNO: LQW18AN36NG00D
L4 = MyPassives:INDUCTOR: Standard SMD inductor; PARTNO: BRC2012T2R2MD
L5 L17 = MyPassives:INDUCTOR: Standard SMD inductor; PARTNO: HK1608R47J-T
L6 = MyPassives:INDUCTOR: Standard SMD inductor; PARTNO: LQW18ANR13J00D
L7 = MyPassives:INDUCTOR: Standard SMD inductor; PARTNO: LQW18ANR10G00D
L8 L13 = MyPassives:INDUCTOR: Standard SMD inductor; PARTNO: LQW18ANR27J00D
L9 = MyPassives:INDUCTOR: Standard SMD inductor; PARTNO: LQW18AN18NG00D
L10 = MyPassives:INDUCTOR: Standard SMD inductor; PARTNO: LQW18AN22NJ00D
L11 = MyPassives:INDUCTOR: Standard SMD inductor; PARTNO: LQW18AN56NG00D
L14 = MyPassives:INDUCTOR: Standard SMD inductor; PARTNO: LQW18AN10NG00D
L23 = MyPassives:INDUCTOR: Standard SMD inductor; PARTNO: LQW18AN39NG00D
Q1 = transistor-small-signal:BSS84: P-CHANNEL MOS FET; PARTNO: DMP3099L-7
R1 R3 R5-R7 R12 R16 R23 = MyPassives:RESISTOR: Standard SMD resistor; PARTNO: RC0603JR-0710KL
R4 R8 = MyPassives:RESISTOR: Standard SMD resistor; PARTNO: RC0603JR-071K1L
R9 = MyPassives:RESISTOR: Standard SMD resistor; PARTNO: RC0603JR-073KL
R10 = MyPassives:RESISTOR: Standard SMD resistor; PARTNO: RC0603JR-07100RL
R11 = MyPassives:RESISTOR: Standard SMD resistor
R22 = MyPassives:RESISTOR: Standard SMD resistor; PARTNO: RC0603JR-0722RL
S1 = c&k-switch:KMR221NGLFS: Miniature tactile switch, 4-lead SMD; DNP: T; PARTNO: KMR221NGLFS
U1 = diodesinc:AP63203: Low EMI buck converter; PARTNO: AP63203WU-7
U2 = quectel:L70: GPS Module; PARTNO: L70B-M39
U3 = st-power:LDF: Low Noise Adjustable LDO (1A max); PARTNO: LDFPUR
U4 = diodesinc:DMN63D8LDW: Dual N-Channel MOSFET; PARTNO: DMN63D8LDW-7
U5 = nxp:BGA2870: MMIC Wideband Amplifier; PARTNO: BGA2818,115
U6 = eeprom:24LC01B: 1KB I2C EEPROM; PARTNO: 24LC01BT-I/OT
U7 = nxp:AFT0SMS003N; PARTNO: AFT05MS003NT1
U8 = diodesinc:DMG1016UDW: N/P Channel MOSFET pair; PARTNO: DMG1016UDW-7
U10 = johanson-technology:1575AT43A0040E: SMD Ceramic GNSS Antenna; PARTNO: 1575AT43A0040E
U11 U12 = EZRadioPRO:SI4463; PARTNO: SI4463-C2A-GMR
U13 = stm32:STM32L432KXXX; PARTNO: STM32L412K8U6
U15 = skyworks:SKYWORKS-13330397LF: SP2T RF Switch; PARTNO: SKY13330-397LF
X1 X2 = adafruit:XTAL-4: Classic 4-pin 3.2 x 2.5mm crystal; PARTNO: CX3225SB30000D0FPLCC

## Board
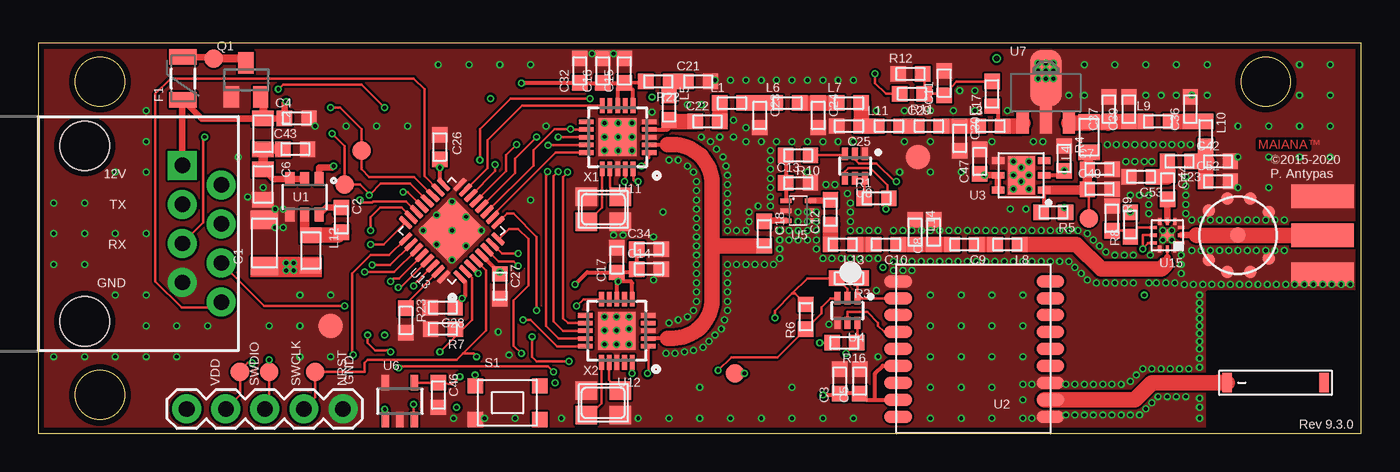
[diagram p7: board, top side]
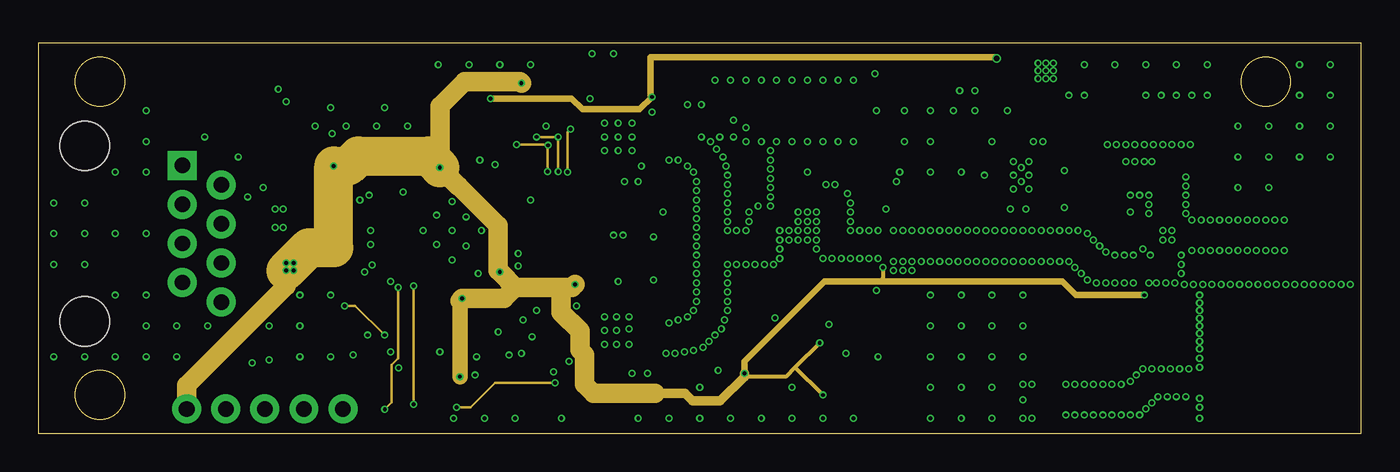
[diagram p8: board, inner layer Layer2]
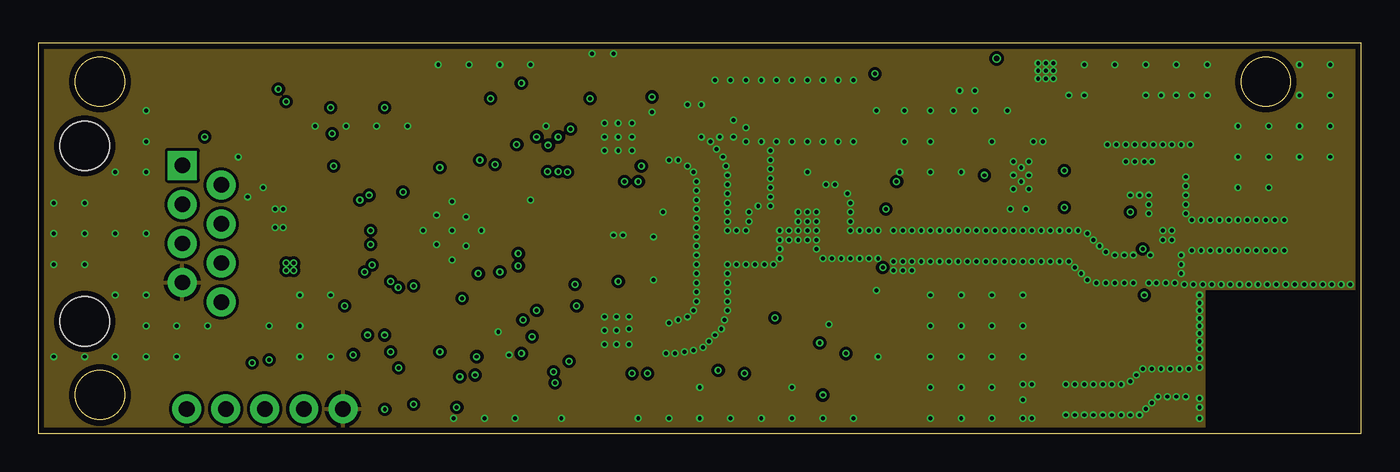
[diagram p9: board, inner layer Layer3]
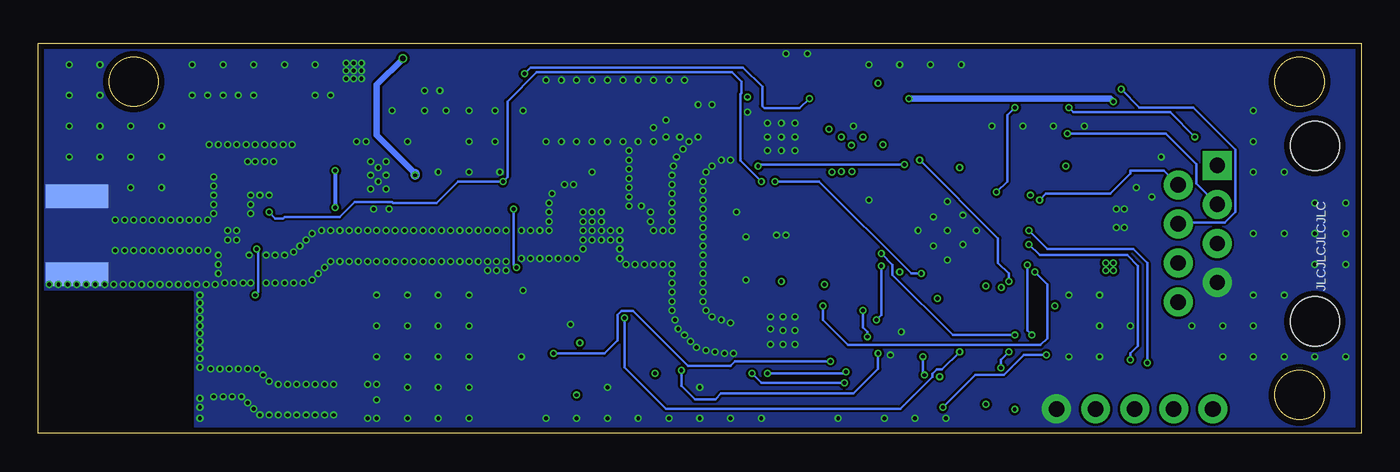
[diagram p10: board, bottom side, seen from below]

Size 86 x 25.4 mm. Coordinates in mm from the lower left corner, seen from the top.
Outline: 0,0 86,0 86,25.4 0,25.4 0,0
Outline: circle at 79.8,22.9 radius 1.6
Outline: circle at 4,2.5 radius 1.6
Outline: circle at 4,22.9 radius 1.6
Copper layers (1+2*15+16): Top 0.035mm / dielectric 0.17mm / Layer2 0.018mm / dielectric 1.2mm / Layer3 0.018mm / dielectric 0.17mm / Bottom 0.035mm
Design rules "default *": minimum track width 5mil, minimum drill 10mil, track to track 6mil, track to pad 6mil, pad to pad 6mil, via to via 6mil, smd to smd 0mil, copper to edge 15mil, drill to drill 6mil, minimum pad ring 4mil, minimum via ring 4mil, stop-mask expansion 0mil, vias tented up to drill 20mil, thermal gap 10mil
tRestrict: area 76,0 to 86.2,9.2
bRestrict: area 76,0 to 86.2,9.2

### Footprints (pad centres in the part's own frame; a part is rotated, then mirrored left to right if it is on the bottom)
TP12R = smd 1.2 x 1.2: TP 0,0
1206 = smd 1.2 x 1.8: P$1 -1.5,0; P$2 1.5,0
0603 = smd 1 x 1: P$1 -0.8,0; P$2 0.8,0
0805 = smd 1 x 1.4: P$1 -1,0; P$2 1,0
PTC-1206 = smd 1 x 1.8: 1 -1.4,0; 2 1.4,0
TP16R = smd 1.6 x 1.6: TP 0,0
SMA-EDGE = smd 1.524 x 4.064: GND@0 0,0; GND@1 5.08,0; SIG 2.54,0 | smd 1.524 x 4.064 bottom: GND@2 0,0; GND@3 5.08,0
1X05 = drill 1.016 pad 1.88: 1 0,0; 2 2.54,0; 3 5.08,0; 4 7.62,0; 5 10.16,0
RJ45-8 = drill 1 pad 1.88 square: 1 -4.445,6.35 | drill 1 pad 1.88: 2 -3.175,8.89; 3 -1.905,6.35; 4 -0.635,8.89; 5 0.635,6.35; 6 1.905,8.89; 7 3.175,6.35; 8 4.445,8.89 | hole 3.2: -5.715,0; 5.715,0
SOT23 = smd 1 x 1.4: 1 -0.95,-1.1; 2 0.95,-1.1; 3 0,1.1
KMR221NGLFS = smd 1 x 1: P$1 -2.1,1.1; P$2 -2.1,-1.1; P$3 2.1,-1.1; P$4 2.1,1.1
TP10R = smd 1 x 1: TP 0,0
TP08R = smd 0.8 x 0.8: TP 0,0
SOT23-6 = smd 0.6 x 0.9: 1 -0.95,-1.15; 2 0,-1.15; 3 0.95,-1.15; 4 0.95,1.15; 5 0,1.15; 6 -0.95,1.15
GPS_MODULE = smd 1.8 x 0.8: P$1 -4.9,4.4; P$2 -4.9,3.3; P$3 -4.9,2.2; P$4 -4.9,1.1; P$5 -4.9,0; P$6 -4.9,-1.1; P$7 -4.9,-2.2; P$8 -4.9,-3.3; P$9 -4.9,-4.4; P$10 5,-4.4; P$11 5,-3.3; P$12 5,-2.2; P$13 5,-1.1; P$14 5,0; P$15 5,1.1; P$16 5,2.2; P$17 5,3.3; P$18 5,4.4
DFN-6 = smd 0.8 x 0.45: P$1 -1.5,0.95; P$2 -1.5,0; P$3 -1.5,-0.95; P$4 1.5,-0.95; P$5 1.5,0; P$6 1.5,0.95 | smd 1.75 x 2.5: P$7 0,0
SOT363 = smd 0.4 x 0.8: 1 -0.65,-0.8; 2 0,-0.8; 3 0.65,-0.8; 4 0.65,0.8; 5 0,0.8; 6 -0.65,0.8
SOT363' = smd 0.3 x 0.7: 1 -0.65,-0.8; 2 0,-0.8; 3 0.65,-0.8; 4 0.65,0.8; 5 0,0.8; 6 -0.65,0.8
SOT23-5 = smd 0.5 x 1: 1 -0.95,-1.2; 2 0,-1.2; 3 0.95,-1.2; 4 0.95,1.2; 5 -0.95,1.2
SOT-89 = smd 0.8 x 1.4: 1 -1.499,-1.981; 3 1.499,-1.981 | smd 0.8 x 1.9: 2 0,-1.727 | smd 2.032 x 3.65: 2@1 0,0.94
1575AT43A0040E = smd 0.635 x 1.27: P$1 -3.2,0; P$2 3.1,0
SI4463 = smd 0.95 x 0.3: 1 -2.05,1; 2 -2.05,0.5; 3 -2.05,0; 4 -2.05,-0.5; 5 -2.05,-1; 11 2.05,-1; 12 2.05,-0.5; 13 2.05,0; 14 2.05,0.5; 15 2.05,1 | smd 0.3 x 0.95: 6 -1,-2.05; 7 -0.5,-2.05; 8 0,-2.05; 9 0.5,-2.05; 10 1,-2.05; 16 1,2.05; 17 0.5,2.05; 18 0,2.05; 19 -0.5,2.05; 20 -1,2.05 | smd 2.45 x 2.45: EXP 0,0
QFN32 = smd 1 x 0.3: 1 -2.5,1.75; 2 -2.5,1.25; 3 -2.5,0.75; 4 -2.5,0.25; 5 -2.5,-0.25; 6 -2.5,-0.75; 7 -2.5,-1.25; 8 -2.5,-1.75; 17 2.5,-1.75; 18 2.5,-1.25; 19 2.5,-0.75; 20 2.5,-0.25; 21 2.5,0.25; 22 2.5,0.75; 23 2.5,1.25; 24 2.5,1.75 | smd 0.3 x 1: 9 -1.75,-2.5; 10 -1.25,-2.5; 11 -0.75,-2.5; 12 -0.25,-2.5; 13 0.25,-2.5; 14 0.75,-2.5; 15 1.25,-2.5; 16 1.75,-2.5; 25 1.75,2.5; 26 1.25,2.5; 27 0.75,2.5; 28 0.25,2.5; 29 -0.25,2.5; 30 -0.75,2.5; 31 -1.25,2.5; 32 -1.75,2.5 | smd 3.2 x 3.2: EXP 0,0
QFN12 = smd 0.44 x 0.2: P$1 -0.9,0.5; P$2 -0.9,0; P$3 -0.9,-0.5; P$7 0.9,-0.5; P$8 0.9,0; P$9 0.9,0.5 | smd 0.2 x 0.44: P$4 -0.5,-0.9; P$5 0,-0.9; P$6 0.5,-0.9; P$10 0.5,0.9; P$11 0,0.9; P$12 -0.5,0.9 | smd 0.76 x 0.76: P$13 0,0
NX3225 = smd 1.4 x 1.2: 1 -1.1,-0.8; 2 1.1,-0.8; 3 1.1,0.8; 4 -1.1,0.8

### Placement (x,y rotation side)
3V3  45.3,3.9 0 top
C1  14.7,12.4 90 top
C2  19.7,13.9 270 top
C3  52.1,3.4 90 top
C4  16.8,20.5 0 top
C5  53.4,3.4 90 top
C6  14.6,16.2 270 top
C7  69,17.2 0 top
C8  58.2,13.1 90 top
C9  60.2,12.3 180 top
C10  55.1,12.3 180 top
C11  58.9,22.8 90 top
C12  51.5,14.4 90 top
C13  49.4,16.3 0 top
C14  39.7,10.7 0 top
C15  38.1,23.6 90 top
C16  36.7,23.6 90 top
C17  37.6,11.28 90 top
C18  47.2,13 270 top
C21  42.9,22.9 0 top
C22  43.5,20.3 0 top
C23  46.9,20.7 270 top
C24  50.7,20.7 270 top
C25  52.7,20 180 top
C26  26.09,18.63 90 top
C27  30.01,9.58 270 top
C28  26.29,8.19 180 top
C29  57.9,20 0 top
C30  59.9,19.2 270 top
C32  35.2,23.6 90 top
C34  39.7,12 0 top
C36  74.9,21.1 90 top
C37  69.6,21.1 90 top
C39  70.9,21.1 90 top
C42  76.7,17.7 0 top
C43  16.7,18.5 0 top
C44  73.41,16.03 270 top
C46  26,2.5 270 top
C47  61.2,17.7 90 top
C49  69,15.9 0 top
C52  76.7,16.4 0 top
C53  71.7,16.7 180 top
F1  9.4,23.1 90 top
GND1  57.2,18 0 top
GND2  19,7 0 top
J$1  83.5,10.35 90 top
JLINK  19.8,1.6 180 top
JP2  3,13 270 top
L1  45.1,21.5 0 top
L2  14.6,19.5 270 top
L3  61.9,20 0 top
L4  68.31,19.29 90 top
L5  41,21.2 270 top
L6  48.7,21.5 0 top
L7  52.7,21.5 0 top
L8  63,12.3 180 top
L9  72.8,20.3 0 top
L10  75.9,19.5 270 top
L11  55.3,20 0 top
L12  17.7,11.9 270 top
L13  52.3,12.3 180 top
L14  57,13.1 270 top
L17  62,22.1 90 top
L23  74.2,17.7 180 top
NRST  18,4 0 top
Q1  13.5,23 0 top
R1  54.5,15.3 0 top
R3  52.7,10.1 180 top
R4  66.7,17.9 270 top
R5  66,14.4 180 top
R6  49.9,7.6 90 top
R7  26.3,6.8 180 top
R8  71,13.6 90 top
R9  69.8,14 270 top
R10  49.4,18.1 180 top
R11  56.8,22.1 180 top
R12  56.7,23.4 0 top
R16  52.4,5.9 180 top
R22  40.3,22.9 180 top
R23  23.89,7.36 270 top
RX  19.9,16.2 0 top
S1  30.5,2 0 top
SWCLK  15,4 0 top
SWDIO  13.1,4 0 top
TP1  78,12.9 0 top
TP2  77.3,15.3 0 top
TP3  77.3,10.5 0 top
TP4  78.8,15.3 0 top
TP5  80,14.4 0 top
TP6  76.1,11.3 0 top
TP7  78.8,10.5 0 top
TP8  76.1,14.5 0 top
TP9  80,11.4 0 top
TX  21,18.4 0 top
U1  17.3,15.4 180 top
U2  60.8,5.5 0 top
U3  63.9,16.8 180 top
U4  52.6,8 180 top
U5  BGA2818,115  [SOT363']  49.4,14.5 270 top
U6  23.5,2.1 0 top
U7  65.5,22.18 0 top
U8  53.1,17.4 180 top
U10  80.49,3.3 0 top
U11  37.66,19.28 180 top
U12  37.61,6.68 180 top
U13  26.88,13.19 135 top
U15  73.4,12.9 180 top
V_BAT  11.4,24.4 0 top
V_PA  68.3,14 0 top
X1  36.73,14.59 0 top
X2  36.72,1.99 0 top

### Tracks (layer width: path | path; a pad name or v marks a point on that pad's centre or on a via)
1V8
  Top 0.152: R9.P$2 70.6,13.2 70.95,12.85 | 70.95,12.85 R8.P$1 | U15.P$7 71.5,13.4 70.95,12.85
3.3V  (via drill 0.25)
  Top 0.152: U6.4 C46.P$1 26.9,3.2 v27.4,3.7 | U15.P$9 72.15,12.4 72.15,12.35 v71.8,12 71.8,12.9 U15.P$8 | 3V3.TP v45.9,3.9 | R16.P$2 v50.8,5.9 | R1.P$2 55.2,15.2 | 55.2,15.2 55.1,15.1 v55.1,14.6 | U8.4 52.45,17.05 52.67,17.27 54.1,17.27 55.2,16.17 55.2,15.2
  Top 0.254: U13.17 26.1,16.45 v26.1,17.3 26.1,17.48 C26.P$1 | U13.5 30.01,10.41 C27.P$1 30,10.29 v30,10.5 | U13.1 27.75,9.85 27.75,8.98 v27.55,8.78 27.55,8.75 C28.P$1 | v51,2.5 52.1,2.5 C3.P$1 C5.P$1 53.8,2.2 54.4,2.2 | U12.8 37.61,9.81 v37.7,9.9 | U12.6 38.61,9.79 38.5,9.9 v37.7,9.9 | C34.P$1 C14.P$1 38.68,10.48 C17.P$1 | C15.P$1 C16.P$1 C32.P$1 v31.4,22.8 | C15.P$1 R22.P$2 | C15.P$1 37.66,22.46 U11.8 | U11.6 38.66,22.34 C15.P$1 | 54.4,2.2 U2.P$8 | v34.9,9.7 35.68,10.48 C17.P$1 | C17.P$1 37.7,10.38 v37.7,9.9 | 54.4,2.2 54.4,3.9 54.9,4.4 U2.P$6
  Top 0.406: C1.P$1 16.1,10.9 | 16.1,10.9 L12.P$2 | 16.1,10.9 v16.1,10.6 | U1.1 18.25,17.3 19.1,17.3 v19.2,17.4
  Layer2 0.254: v16.6,10.6 v16.6,11.1 v16.1,11.1 v16.1,10.6 | v51,2.5 49.2,4.3 | 45.9,3.7 48.6,3.7 49.2,4.3 | v50.8,5.9 49.2,4.3 | v54.9,10.8 54.9,10.1 54.7,9.9
  Layer2 0.406: v45.9,3.9 45.9,4.7 51.1,9.9 54.7,9.9 66.57,9.9 67.46,9.02 71.24,9.02 71.23,9 v71.9,9
  Layer2 0.61: 40.1,2.6 42.03,2.6 42.52,2.11 44.31,2.11 45.9,3.7 v45.9,3.9
  Layer2 1.016: v27.4,3.7 27.4,8.63
  Layer2 1.27: v31.4,22.8 31.3,22.9 27.7,22.9 26.1,21.3 v26.1,17.3 27.28,16.12 27.32,16.12 29.9,13.54 29.9,10.6 v30,10.5 31,9.5 | v34.9,9.7 34.7,9.5 33.6,9.5 | 31,9.5 33.6,9.5 | 27.4,8.63 v27.55,8.78 30.28,8.78 31,9.5 | 33.6,9.5 33.98,9.12 33.98,7.88 35.2,6.66 35.2,5.44 35.52,5.12 35.52,4.28 35.5,4.26 35.5,3.2 36.1,2.6 40.1,2.6 | v16.1,10.6 16.1,9.6 9.64,3.14 JLINK.5
  Layer2 2.54: v16.1,10.6 17.6,12.1 19.2,12.1 v19.2,17.4 20.16,17.4 20.82,18.05 25.35,18.05 v26.1,17.3
  Bottom 0.152: v71.9,9 71.7,9.2 71.7,11.9 v71.8,12 | v55.1,14.6 55.1,11 v54.9,10.8
BOOT0
  Top 0.152: U13.31 23.89,8.43 R23.P$1
BST
  Top 0.406: C2.P$1 18.7,14.7 U1.6
CS1
  Top 0.152: U11.15 33.64,18.28 29.53,14.17 U13.10
CS2  (via drill 0.25)
  Top 0.152: U12.15 33.72,5.68 32,7.4 v31.5,7.4 | v31.2,10.9 30.89,11.21 29.92,11.21 U13.6
  Bottom 0.152: v31.2,10.9 31.2,7.7 v31.5,7.4
GND  (via drill 0.25)
  other vias: 73.9,9.8 73.3,9.8 65.5,23.1 65.5,23.6 65.5,24.1 66,23.1 66,23.6 66,24.1 65,24.1 65,23.6 65,23.1 75.5,1.7 27,1 50,17 26.9,13.2 27.8,12.2 25.9,14.2 25,13.2 26.9,15.1 26.9,11.3 28.8,13.2 25.9,12.3 27.8,14.1 37.6,6.7 37.6,5.8 37.6,7.6 38.4,7.6 38.4,6.8 38.4,5.8 36.8,5.8 36.8,6.7 36.8,7.6 37.7,19.3 37.7,18.4 37.7,20.2 38.6,20.2 38.6,19.3 38.6,18.4 36.8,18.4 36.8,19.3 36.8,20.2 43,1 41,1 39,1 45,23 47,23 75.5,7 75.5,9 75.5,8 75.5,6 75.5,4.9 78.1,9.7 78.7,9.7 79.3,9.7 81.1,9.7 81.7,9.7 82.3,9.7 82.9,9.7 83.5,9.7 84.1,9.7 84.7,9.7 77.5,9.7 75.5,8.5 75.5,7.5 75.5,6.5 75.5,5.5 75.5,2.3 75.5,4.3 79.9,9.7 80.5,9.7 75.5,1 30.6,5.1 29,1 31,1 33,20 40,10 1,11 1,13 39.9,20.9 49,23 51,23 53,23 46,19 48,19 50,19 52,19 51,19 49,19 47,19 46,23 48,23 50,23 52,23 63,21 46,19.9 32,15.2 29.9,6.6 76,24 74,24 72,24 70,24 68,24 68,22 72,22 74,22 76,22 75,22 73,22 67,22 58,17 58,19 60,17 62,19 60.9,21 44,23 54.5,21 64.2,14.6 72.2,14.9 53,19 56,17 56.3,19 63.4,15.9 64.4,15.9 63.4,16.8 63.4,17.7 64.4,17.7 64.4,16.8 63.9,16.4 63.9,17.3 69.5,18.8 70.1,18.8 70.7,18.8 71.3,18.8 71.9,18.8 72.5,18.8 73.1,18.8 73.7,18.8 74.3,18.8 74.9,18.8 74.6,16.7 74.6,16.1 72.2,15.5 74.6,15.5 72.2,14.3 74.6,14.9 78,20 85.3,9.7 1,15 3,15 3,13 3,11 5,9 7,9 5,13 7,13 5,17 7,17 7,19 7,7 9,7 1,5 56.3,21 58,21 64.7,19 65.3,19 59.5,21 60.9,22.3 59.9,22.3 76.9,9.7 76.3,9.7 75.7,9.7 73.1,13.2 73.7,13.2 73.1,12.6 73.7,12.6 74.6,14.3 72.7,9.8 75.6,13.9 76.2,13.9 76.8,13.9 77.4,13.9 78,13.9 78.6,13.9 79.2,13.9 79.8,13.9 80.4,13.9 81,13.9 75.6,11.9 76.2,11.9 76.8,11.9 77.4,11.9 78,11.9 78.6,11.9 79.2,11.9 79.8,11.9 80.4,11.9 81,11.9 70.7,17.7 71.3,17.7 71.9,17.7 72.4,17.7 71.6,15.5 71,15.5 82,24 84,24 84,22 82,22 82,20 84,20 84,18 82,18 80,20 80,18 80,16 13,18 15.4,14.6 15.9,14.6 15.9,13.4 15.4,13.4 74.5,9.7 75.1,9.7 72.3,11.6 45,1 47,1 49,1 58,1 60,1 62,1 64,1 74.8,4.2 74.2,4.2 73.6,4.2 73,4.2 72.4,4.2 71.8,4.2 71.4,3.8 71,3.4 70.4,3.2 69.8,3.2 69.2,3.2 68.6,3.2 68,3.2 68,1.2 68.6,1.2 69.2,1.2 69.8,1.2 70.4,1.2 71,1.2 71.6,1.2 72,1.6 72.4,2 72.8,2.4 73.4,2.4 74,2.4 74.6,2.4 67.4,3.2 66.8,3.2 67.4,1.2 66.8,1.2 64,2.2 64,3.2 64.6,3.2 64.6,1 60,3 60,5 60,7 62,3 62,5 62,7 64,7 64,5 63.2,14.6 51.4,7.1 54.6,5 69.4,11.8 69,12.2 68.6,12.6 68.2,13 67.6,13.2 67,13.2 66.4,13.2 65.8,13.2 65.2,13.2 64.6,13.2 64,13.2 63.4,13.2 62.8,13.2 62.2,13.2 61.6,13.2 61,13.2 60.4,13.2 59.8,13.2 59.2,13.2 58.6,13.2 58,13.2 57.4,13.2 56.8,13.2 56.2,13.2 55.6,13.2 54,13.2 53.4,13.2 52.8,13.2 52.8,13.8 52.8,14.4 52.8,15 52.6,15.6 49.4,14.4 49.4,13.8 49.4,13.2 49.4,12.6 50,13.2 50,12.6 50.6,13.2 50.6,12.6 50,13.8 50.6,13.8 50,14.4 48.8,13.2 48.2,13.2 48.2,12.6 48.8,12.6 48.2,12 48.2,11.4 47.8,11 47.2,11 46.6,11 46,11 45.4,11 44.8,11 44.8,10.4 44.8,9.8 44.8,9.2 44.8,8.6 44.8,8 44.6,7.4 44.4,6.8 44,6.4 43.6,6 43.2,5.6 42.6,5.4 47.6,14.8 46.8,14.8 46.2,14.4 46.2,13.8 45.4,13.2 44.8,13.2 46,13.2 44.8,13.8 44.8,14.4 44.8,15 44.8,15.6 44.8,16.2 44.8,16.8 44.7,17.4 44.5,18 44.1,18.5 43.7,19 43.1,19.3 42.8,11 42.8,10.4 42.8,9.8 42.8,9.2 42.8,8.6 42.6,8 42.2,7.6 41.6,7.4 41,7.2 42.8,11.6 42.8,12.2 42.8,12.8 42.8,13.4 42.8,14 42.8,14.6 42.8,15.2 42.8,15.8 42.8,16.4 42.6,17 42.2,17.4 41.6,17.8 41,17.8 40.6,14.4 69.4,9.8 68.8,9.8 68.2,10 67.8,10.4 67.4,10.8 67,11.2 66.4,11.2 65.8,11.2 65.2,11.2 64.6,11.2 64,11.2 63.4,11.2 62.8,11.2 62.2,11.2 61.6,11.2 61,11.2 60.4,11.2 59.8,11.2 59.2,11.2 58.6,11.2 58,11.2 57.4,11.2 56.8,11.2 56.2,11.2 55.6,11.2 54,11.4 53.4,11.4 52.8,11.4 52.2,11.4 51.6,11.4 51,11.4 50.6,12 42,5.3 50.6,14.4 74.3,11.6 74.3,11 74.3,10.4 75,11.9 75,13.9 78,18 78,16 44.3,19.3 45.2,19.3 45.2,20.4 41.4,5.2 47.6,15.4 47.6,16 47.6,16.6 47.6,17.2 47.6,17.8 47.6,18.4 13.6,15.4 14.6,16 51.2,16.2 51.8,16.2 54.6,13.2 54.6,11.4 43.1,21.4 42.2,21.4 70,9.8 70.6,9.8 71.2,9.8 70,11.6 70.6,11.6 71.2,11.6 72.2,9.8 40,12.8 37.4,12.9 38,12.9 36,24.7 37.4,24.7 40.8,5.2 3,5 5,5 7,5 9,5 7,21 26,24 20,20 22,20 24,20 18,20 28,24 30,24 32,24 51,1 53,1 49,3 43,3 34,1 11,7 15,7 17,7 17,5 17,9 19,9 19,5 58,7 58,9 60,9 62,9 64,9 58,5 58,3 54.5,9.3 55.6,10.6 56.2,10.6 56.8,10.6
  pour Top (isolate 0.1, no thermals): -1,26 88.2,26 88.2,-0.9 -1,-0.9
  pour Bottom (isolate 0.1, no thermals): -3,28 89,28 89,-3 -3,-3
  pour Layer3 (isolate 0.2): -1.6,27 87.3,27 87.3,9.4 75.8,9.4 75.8,-2.4 -1.6,-2.4
GPS_1PPS
  Top 0.152: U4.5 52.6,7.9 53.9,7.9 54.6,7.2 54.6,7 55,6.6 U2.P$4
GPS_EN  (via drill 0.25)
  Top 0.152: U13.2 27.79,10.54 28.21,10.12 28.21,7.41 27.35,6.55 | 27.35,6.55 v26.1,5.3 | R7.P$1 27.35,6.55 | U4.2 52.6,9.4 R3.P$2 50,10.1 49,9.1 | v47.89,7.51 47.89,7.99 49,9.1 | R6.P$2 49.2,9.1 49,9.1
  Bottom 0.152: v26.1,5.3 27.24,4.16 27.59,4.16 27.86,3.89 27.86,3.7 29.94,1.62 45.2,1.62 47.89,4.3 v47.89,7.51
GPS_STATUS  (via drill 0.25)
  Top 0.152: U13.21 24.02,15.7 v23.7,15.7 | v22.5,21.2 21,22.7 15.9,22.7 v15.6,22.4
  Bottom 0.152: v23.7,15.7 23,16.4 23,20.7 v22.5,21.2 | v15.6,22.4 14.4,21.2 10.91,21.2 8.18,18.48 8.18,14.42 8.87,13.74 11.79,13.74 JP2.4
GPS_UART_TX
  Top 0.152: U2.P$2 U4.1 53.25,9.9 53.3,9.95 53.35,9.95 R3.P$1
I2C_SCL  (via drill 0.25)
  Top 0.152: U13.29 23.54,9.5 v23.4,9.5 | U6.1 22.52,0.93 v22.52,1.58
  Layer2 0.152: v23.4,9.5 23.4,4.9 22.96,4.47 22.96,2.02 v22.52,1.58
I2C_SDA  (via drill 0.25)
  Top 0.152: U13.30 24.4,9.65 v24.4,9.6 | U6.3 24.4,0.95 v24.4,1.9
  Layer2 0.152: v24.4,9.6 v24.4,1.9
MCU_GPS_1PPS  (via drill 0.25)
  Top 0.152: U13.8 29.96,12.66 30.6,13.3 31.2,13.3 31.86,12.64 31.86,9.63 30.9,8.67 30.9,5.7 v31.4,5.2 | v44.2,4.1 45.06,4.96 48.06,4.96 R6.P$1 50.9,7.8 50.9,8.2 51.5,8.8 U4.3
  Bottom 0.152: v44.2,4.1 44.2,3.1 43.32,2.22 41.98,2.22 41.6,2.6 33,2.6 31.4,4.2 v31.4,5.2
MCU_GPS_UART_RX  (via drill 0.25)
  Top 0.152: U13.9 30.48,14.32 30.88,14.32 32.4,12.8 v32.4,8 | v32.1,6.3 32.1,5 32.4,4.7 v34.5,4.7 | U4.6 53.25,5.95 R16.P$1 v52.5,5.2
  Bottom 0.152: v32.4,8 32.4,6.9 32.1,6.6 v32.1,6.3 | v34.5,4.7 40.7,4.7 41.01,4.39 43.78,4.39 47.35,7.97 48.08,7.97 48.34,7.7 48.34,6.06 49.2,5.2 v52.5,5.2
MCU_UART_RX  (via drill 0.25)
  Top 0.152: U13.20 24.16,16.26 22.26,16.26 21.55,15.55 | 21.55,15.55 v21.5,15.5 | 21.55,15.55 20.9,16.2 RX.TP 19.9,18.7 v19.1,19.5
  Bottom 0.152: v19.1,19.5 12.7,19.5 10.72,17.52 10.72,16.27 JP2.3
MCU_UART_TX  (via drill 0.25)
  Top 0.152: U13.19 24.43,16.7 21.5,16.7 21,17.2 TX.TP 21,19.8 19.6,21.2 v19,21.2 | JP2.5 10.7,13.71 10.7,19.2 v10.8,19.3
  Bottom 0.152: v19,21.2 18.7,20.9 12.4,20.9 v10.8,19.3
MISO  (via drill 0.25)
  Top 0.152: U11.13 33.82,19.28 v33.8,19.3 | v32.4,19.3 31,17.9 31,16.96 U13.12 | U12.13 34.12,6.68 33.5,7.3 33.5,16.74 v33.8,17.04
  Layer2 0.152: v32.4,19.3 v33.8,19.3 v33.8,17.04
MOSI  (via drill 0.25)
  Top 0.152: U11.14 33.18,18.78 v33.15,18.75 | U13.13 30.4,17.06 30.4,18.1 v31.1,18.8 | U12.14 33.82,6.18 33,7 33,16.94 v33.1,17.04
  Layer2 0.152: v31.1,18.8 33.1,18.8 v33.15,18.75 33.1,18.7 v33.1,17.04
N$1
  Top 0.406: U5.6 51.45,15.15 C12.P$2
N$2
  Top 1: L8.P$2 C9.P$1
N$3
  Top 1: C9.P$2 C8.P$1 L14.P$2 C10.P$1
N$4
  Top 1: C10.P$2 L13.P$1
N$5
  Top 1: L13.P$2 C12.P$1
N$6
  Top 0.254: U5.1 C13.P$1 R10.P$2
N$7
  Top 1.016: L6.P$2 C24.P$1 L7.P$1
N$8
  Top 0.152: L17.P$2 59.7,22.9 C11.P$1 58.8,22.1 R11.P$1 57.6,23.3 R12.P$2
N$9
  Top 0.406: U5.3 47.25,13.85 C18.P$1
N$10
  Top 0.152: U8.5 U8.6 53.7,16.55 R1.P$1
N$11
  Top 1.016: L7.P$2 C25.P$1 L11.P$1
N$12
  Top 1.016: L1.P$2 C23.P$1 L6.P$1
N$15
  Top 0.152: TP1.TP 78.29,12.89 76.8,12.89
  Top 0.406: 75.3,12.9 U15.P$2
  Top 1: J$1.SIG 76.8,12.89 75.31,12.89 75.3,12.9
N$16
  Top 0.152: X2.1 35.84,1.19 36.61,1.96 U12.16
N$17
  Top 0.152: U12.17 37.11,3.5 X2.3
N$18
  Top 0.152: X1.1 35.75,13.79 36.66,14.7 U11.16
N$19
  Top 0.152: U11.17 37.16,16.06 X1.3
N$23
  Top 0.61: 68.3,20.2 L4.P$2 | 69.55,20.19 C37.P$1
  Top 1: U7.3 68.3,20.2 | L4.P$2 69.55,20.19 | C37.P$1 C39.P$1 L9.P$1
N$24
  Top 0.254: U11.4 40.91,19.78 41,19.87 L5.P$2
  Top 1.016: L5.P$2 41.1,20.3 C22.P$1
N$25
  Top 0.813: 65.4,2.2 U2.P$11
  Top 1: U10.P$1 72.4,3.3 71.3,2.2 65.4,2.2
N$26
  Top 0.254: L17.P$1 62.4,20.9 62.4,20 L3.P$2
  Top 1.016: L3.P$2 63.8,20 U7.1
N$27
  Top 0.406: U1.2 U1.3 15.25,16.55 C6.P$1
  Top 0.61: C43.P$1 L2.P$2 C6.P$1
N$28
  Top 1: L9.P$2 C36.P$1 L10.P$1
N$29
  Top 1.016: L3.P$1 C30.P$1 C29.P$2
N$30
  Top 0.406: C21.P$1 R22.P$1 L5.P$1
N$31
  Top 1.016: L1.P$1 C22.P$2
N$32  (via drill 0.25)
  Top 0.254: R5.P$1 66.75,14.65 v66.7,14.7 | U3.P$2 66.4,16.8 R4.P$2
  Bottom 0.254: R4.P$2 v66.7,14.7
  other vias: 66.7,17.1
N$40
  Top 0.254: L23.P$1 75.03,17.73
  Top 1: C42.P$1 75.97,17.73 75.03,17.73 | C42.P$1 L10.P$2 | C42.P$1 C52.P$1
N$41
  Top 0.254: C44.P$1 73.38,16.7 | L23.P$2
  Top 1: 73.38,16.7 C53.P$1 | L23.P$2 C44.P$1
NRST  (via drill 0.25)
  Top 0.152: U13.4 29.1,10.62 29.1,6.7 27.6,5.2 | 27.6,5.2 27.2,4.8 21.4,4.8 21.2,4.6 21.2,4 NRST.TP 18,2.34 JLINK.2 | 27.6,5.2 28.3,5.2 v28.5,5 | S1.P$1 v28.4,3.8
  Bottom 0.152: v28.5,5 28.5,3.9 v28.4,3.8
PA_IN
  Top 1.016: L11.P$2 C29.P$1
PA_OUT
  Top 0.254: U15.P$5
  Top 0.406: C44.P$2 U15.P$5
RF_IN
  Top 0.152: U15.P$11 73.4,11.5
  Top 0.406: 73.4,11.5 73.4,11 73.3,11
  Top 1: 73.3,11 73,10.7 69.1,10.7 67.5,12.3 L8.P$1
RX_EN  (via drill 0.25)
  Top 0.152: U11.20 38.7,17.19 38.7,16.5 38.8,16.4 v39,16.4 | v55.8,16.39 55.68,16.39 54.5,17.57 53.35,17.57 53.1,17.83 U8.2
  Bottom 0.152: v39,16.4 40.36,17.76 40.36,22.09 40.3,22.15 40.3,22.9 40.9,23.5 53.6,23.5 55.5,21.59 55.5,16.69 v55.8,16.39 58.71,16.39 60.1,15 62.95,15 63.01,15.06 65.44,15.06 66.4,14.1 70,14.1 70.1,14 70.6,14 R8.P$2
  other vias: 71,14.4
RX_IC_CLK  (via drill 0.25)
  Top 0.152: U13.26 22.88,10.96 v21.7,10.96 | v23.42,4.28 23.52,4.38 33.12,4.38 v33.5,4 | U12.20 v38.61,3.91 v38.6,3.9 | v21.4,6.4 21.4,5.9 21.9,5.4 22.8,5.4 v22.9,5.3
  Bottom 0.152: v38.6,3.9 33.6,3.9 v33.5,4 | v21.7,10.96 21.7,6.7 v21.4,6.4 | v22.9,5.3 23.42,4.78 v23.42,4.28
RX_IC_DATA  (via drill 0.25)
  Top 0.152: U13.27 23.13,10.5 v21.2,10.5 | U12.10 35.43,8.73 v35,8.3
  Bottom 0.152: v35,8.3 35,7.4 33.36,5.76 20.84,5.76 20.4,6.2 20.4,9.7 v21.2,10.5
RX_IN
  Top 0.254: 40.9,18.8 39.73,18.8 arc90 U11.2 | 40.9,6.2 39.68,6.2 arc90 U12.2
  Top 1: 40.9,18.8 41.26,18.8 arc-90 43.8,16.26 43.8,12.2 | 40.9,6.2 41.26,6.2 arc90 43.8,8.74 43.8,12.2 | C18.P$2 43.8,12.2
RX_STATUS  (via drill 0.25)
  Top 0.152: U13.7 30.14,11.7 v31.2,11.7 | JP2.6 14.69,8.3 v19.9,8.3
  Layer2 0.152: v22.5,6.4 20.6,8.3 v19.9,8.3
  Bottom 0.152: v31.2,11.7 30.46,10.96 30.46,10.31 26.55,6.4 v22.5,6.4
SCK  (via drill 0.25)
  Top 0.152: U12.12 34.42,7.18 34.1,7.5 34.1,16.69 v34.41,17 | U13.11 32.18,17.43 32.18,18.43 33.55,19.8 v34.6,19.8 34.62,19.78 U11.12
  Layer2 0.152: v34.41,17 34.41,19.61 v34.6,19.8
SDN1  (via drill 0.25)
  Top 0.152: U13.14 29.7,17.07 v29.7,17.5 | U11.1 39.71,17.91 v39.2,17.4
  Bottom 0.152: v39.2,17.4 39.1,17.5 v29.7,17.5
SDN2  (via drill 0.25)
  Top 0.152: U13.25 22.82,11.6 21.6,11.6 20.4,10.4 20.4,5.2 v20.47,5.13 | U12.1 39.66,3.96 v39.6,3.9
  Layer2 0.152: v27.2,1.7 28.1,1.7 29.7,3.3 v33.6,3.3
  Bottom 0.152: v33.6,3.3 39,3.3 v39.6,3.9 | v20.47,5.13 21.93,5.13 23.23,3.82 25.08,3.82 v27.2,1.7
SW
  Top 0.406: L12.P$1 17.7,12.95 17.3,13.35
  Top 0.61: 17.3,13.35 U1.5
  Top 1.016: C2.P$2 19.5,12.9 L12.P$1
SWCLK  (via drill 0.25)
  Top 0.152: U13.24 22.45,12.3 v21.6,12.3 | v15,4.8 SWCLK.TP 15,1.88 JLINK.3
  Bottom 0.152: v15,4.8 15,5.2 14.5,5.7 14.5,10.9 15.2,11.6 20.9,11.6 v21.6,12.3
SWDIO  (via drill 0.25)
  Top 0.152: U13.23 23.6,14.7 22.2,14.7 21.6,14.1 v21.6,13.2 | v13.9,4.6 13.6,4.6 13.1,4.1 SWDIO.TP 13.1,2.52 JLINK.4
  Bottom 0.152: v21.6,13.2 20.4,12 14.8,12 13.9,11.1 v13.9,4.6
TRX_IC_CLOCK  (via drill 0.25)
  Top 0.152: U11.19 38.16,16.46 v38.1,16.4 | v28.6,10.4 v28.61,10.41 28.61,10.43 28.15,10.89 U13.3
  Bottom 0.152: v38.1,16.4 35.24,16.4 29.24,10.4 v28.6,10.4
TRX_IC_DATA
  Top 0.152: U13.15 29.2,17.28 29.2,19.1 31.43,21.33 U11.10
TX_DISABLE  (via drill 0.25)
  Top 0.152: U13.22 23.91,15.1 21.75,15.1 21.69,15.04 21.06,15.04 v20.9,15.2
  Bottom 0.152: v20.9,15.2 20.5,15.6 16.3,15.6 15,16.9 15,17.1 12.81,17.1 JP2.2
TX_STATUS
  Top 0.152: U13.18 25.1,16.74 25.1,22.4 24.4,23.1 8.6,23.1 7.6,22.1 7.6,9.9 9.3,8.2 11.54,8.2 JP2.8
V_BAT
  Top 0.406: F1.2 11.3,24.5 V_BAT.TP
  Top 0.508: Q1.3 13.2,24.4 V_BAT.TP
V_IN  (via drill 0.25, 0.35)
  Top 0.406: v61.5,16.8 U3.P$5 U3.P$6 | v16.1,21.6 16,21.5 C4.P$1 L2.P$1 10.6,20.5 F1.1 9.35,21.65 JP2.1
  Top 0.508: Q1.2 14.6,21.75 L2.P$1
  Top 0.61: C47.P$1 61.44,16.77 61.47,16.8 v61.5,16.8
  Layer2 0.406: v62.3,24.4 62.2,24.5 39.8,24.5 39.8,22 v39.9,21.9 39.09,21.09 35.37,21.09 34.66,21.8 v29.4,21.8
  Bottom 0.406: v62.3,24.4 64,22.7 64,19.4 61.5,16.9 | v16.1,21.6 16.3,21.8 v29.4,21.8
  Bottom 0.61: 61.5,16.9 v61.5,16.8
V_LNA
  Top 0.152: U8.3 52.35,18.1 R10.P$1
V_PA
  Top 0.152: C49.P$1 68.3,15.8 V_PA.TP
  Top 0.254: R5.P$2 65.4,14.6 U3.P$1
  Top 0.61: L4.P$1 68.4,18.3 68.3,18.2 C7.P$1 C49.P$1 68.15,15.85 U3.P$1
V_PA_BIAS  (via drill 0.25)
  Top 0.152: v22.9,9.9 23.1,10.1 23.44,10.1 U13.28 | v35.88,21.8 30.7,21.8 28.7,19.8 v28.7,17.8 | R11.P$2 55.1,22.1 54.4,22.8 v54.4,23.4
  Top 0.254: U13.28
  Bottom 0.152: v35.88,21.8 36.51,21.17 38.8,21.17 38.93,21.3 38.93,22.55 40.18,23.8 54,23.8 v54.4,23.4 | v22.9,9.9 22.9,10.4 23.6,11.1 23.6,12.7 v28.7,17.8
(copper drawn outside any net)
  shapes: Top area x2

### Text on the board
Top: MAIANA™
tPlace: Rev 9.3.0
tNames: 12V | ©2015-2020 / P. Antypas | TX | RX | GND | VDD | GND
bNames: JLCJLCJLCJLC